# Altium project ECSE478 - DAQ Device.PrjPcb (part 2 of 4)

## Sheet Microcontroller.SchDoc: Microcontroller
size B; DrawnBy: Jasper Yun; SheetNumber: 5; SheetTotal: 13; Competition: SAC 2021; Subteam: Avionics; University: McGill University; Location: Montreal, Quebec; Project: Avionics Project Name; MRT: McGill Rocket Team
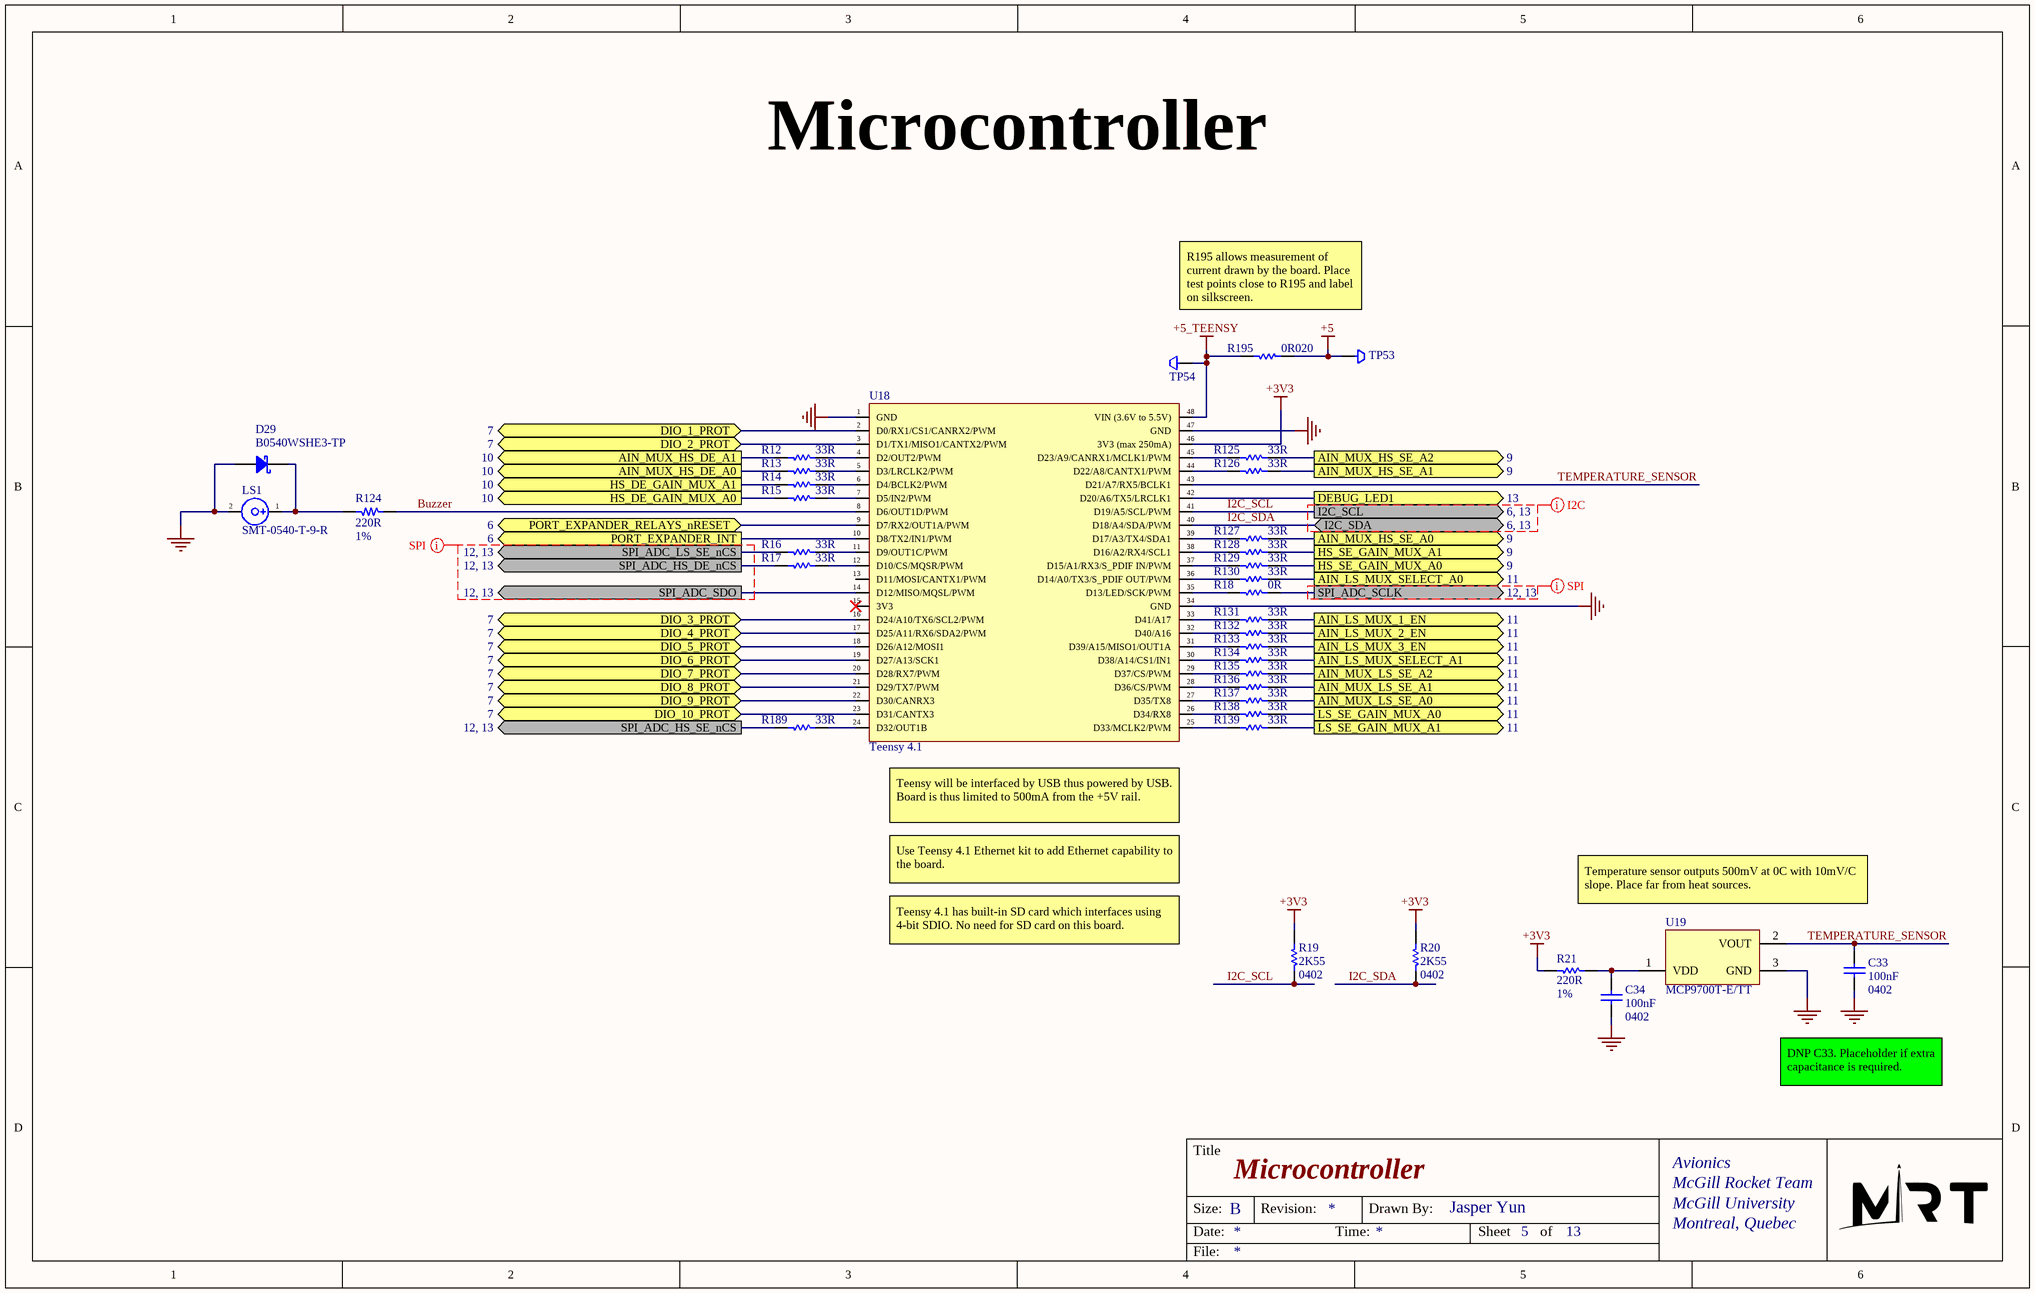
[diagram p4: Microcontroller.SchDoc]

### Parts
C33  100nF  value 0402  [0402 CAP]
C34  100nF  value 0402  [0402 CAP]
D29  B0540WSHE3-TP  [Diode SOD323-F]
LS1  SMT-0540-T-9-R  [Buzzer SMT-0540-T-9-R]
R12  33R  [0402 RES]
R13  33R  [0402 RES]
R14  33R  [0402 RES]
R15  33R  [0402 RES]
R16  33R  [0402 RES]
R17  33R  [0402 RES]
R18  0R  [0402 RES]
R19  2K55  value 0402  [0402 RES]
R20  2K55  value 0402  [0402 RES]
R21  220R  value 1%  [0402 RES]
R124  220R  Tolerance: 1%  [0402 RES]
R125  33R  [0402 RES]
R126  33R  [0402 RES]
R127  33R  [0402 RES]
R128  33R  [0402 RES]
R129  33R  [0402 RES]
R130  33R  [0402 RES]
R131  33R  [0402 RES]
R132  33R  [0402 RES]
R133  33R  [0402 RES]
R134  33R  [0402 RES]
R135  33R  [0402 RES]
R136  33R  [0402 RES]
R137  33R  [0402 RES]
R138  33R  [0402 RES]
R139  33R  [0402 RES]
R189  33R  [0402 RES]
R195  0R020  [0805 RES]
TP53  Test Point - Keystone 5015  [Test Point Keystone 5015]  (value not drawn)
TP54  Test Point - Keystone 5015  [Test Point Keystone 5015]  (value not drawn)
U18  Teensy 4.1  [Teensy 4.1]
U19  MCP9700T-E/TT  [SOT-23-TT3_M]

### Ports
AIN_LS_MUX_1_EN (out, see 11), AIN_LS_MUX_2_EN (out, see 11), AIN_LS_MUX_3_EN (out, see 11), AIN_LS_MUX_SELECT_A0 (out, see 11), AIN_LS_MUX_SELECT_A1 (out, see 11), AIN_MUX_HS_DE_A0 (out, see 10), AIN_MUX_HS_DE_A1 (out, see 10), AIN_MUX_HS_SE_A0 (out, see 9), AIN_MUX_HS_SE_A1 (out, see 9), AIN_MUX_HS_SE_A2 (out, see 9), AIN_MUX_LS_SE_A0 (out, see 11), AIN_MUX_LS_SE_A1 (out, see 11), AIN_MUX_LS_SE_A2 (out, see 11), DEBUG_LED1 (out, see 13), DIO_1_PROT (bidir, see 7), DIO_2_PROT (bidir, see 7), DIO_3_PROT (bidir, see 7), DIO_4_PROT (bidir, see 7), DIO_5_PROT (bidir, see 7), DIO_6_PROT (bidir, see 7), DIO_7_PROT (bidir, see 7), DIO_8_PROT (bidir, see 7), DIO_9_PROT (bidir, see 7), DIO_10_PROT (bidir, see 7), HS_DE_GAIN_MUX_A0 (out, see 10), HS_DE_GAIN_MUX_A1 (out, see 10), HS_SE_GAIN_MUX_A0 (out, see 9), HS_SE_GAIN_MUX_A1 (out, see 9), I2C_SCL (out, see 6, 13), I2C_SDA (bidir, see 6, 13), LS_SE_GAIN_MUX_A0 (out, see 11), LS_SE_GAIN_MUX_A1 (out, see 11), PORT_EXPANDER_INT (out, see 6), PORT_EXPANDER_RELAYS_nRESET (bidir, see 6), SPI_ADC_HS_DE_nCS (out, see 12, 13), SPI_ADC_HS_SE_nCS (out, see 12, 13), SPI_ADC_LS_SE_nCS (out, see 12, 13), SPI_ADC_SCLK (out, see 12, 13), SPI_ADC_SDO (out, see 12, 13)

### Nets
+3V3: R19.1 R20.1 R21.1 U18.46(3V3_(max_250mA))
+5: R195.2 TP53.1
+5_TEENSY: R195.1 TP54.1 U18.48(VIN_(3.6V_to_5.5V))
GND: C33.1 C34.1 D29.1 LS1.2(K) U18.1(GND) U18.34(GND) U18.47(GND) U19.3(GND)
AIN_LS_MUX_1_EN: R131.2 ; port AIN_LS_MUX_1_EN
AIN_LS_MUX_2_EN: R132.2 ; port AIN_LS_MUX_2_EN
AIN_LS_MUX_3_EN: R133.2 ; port AIN_LS_MUX_3_EN
AIN_LS_MUX_SELECT_A0: R130.2 ; port AIN_LS_MUX_SELECT_A0
AIN_LS_MUX_SELECT_A1: R134.2 ; port AIN_LS_MUX_SELECT_A1
AIN_MUX_HS_DE_A0: R13.1 ; port AIN_MUX_HS_DE_A0
AIN_MUX_HS_DE_A1: R12.1 ; port AIN_MUX_HS_DE_A1
AIN_MUX_HS_SE_A0: R127.2 ; port AIN_MUX_HS_SE_A0
AIN_MUX_HS_SE_A1: R126.2 ; port AIN_MUX_HS_SE_A1
AIN_MUX_HS_SE_A2: R125.2 ; port AIN_MUX_HS_SE_A2
AIN_MUX_LS_SE_A0: R137.2 ; port AIN_MUX_LS_SE_A0
AIN_MUX_LS_SE_A1: R136.2 ; port AIN_MUX_LS_SE_A1
AIN_MUX_LS_SE_A2: R135.2 ; port AIN_MUX_LS_SE_A2
Buzzer: R124.1 U18.8(D6/OUT1D/PWM)
DEBUG_LED1: U18.42(D20/A6/TX5/LRCLK1) ; port DEBUG_LED1
DIO_1_PROT: U18.2(D0/RX1/CS1/CANRX2/PWM) ; port DIO_1_PROT
DIO_2_PROT: U18.3(D1/TX1/MISO1/CANTX2/PWM) ; port DIO_2_PROT
DIO_3_PROT: U18.16(D24/A10/TX6/SCL2/PWM) ; port DIO_3_PROT
DIO_4_PROT: U18.17(D25/A11/RX6/SDA2/PWM) ; port DIO_4_PROT
DIO_5_PROT: U18.18(D26/A12/MOSI1) ; port DIO_5_PROT
DIO_6_PROT: U18.19(D27/A13/SCK1) ; port DIO_6_PROT
DIO_7_PROT: U18.20(D28/RX7/PWM) ; port DIO_7_PROT
DIO_8_PROT: U18.21(D29/TX7/PWM) ; port DIO_8_PROT
DIO_9_PROT: U18.22(D30/CANRX3) ; port DIO_9_PROT
DIO_10_PROT: U18.23(D31/CANTX3) ; port DIO_10_PROT
HS_DE_GAIN_MUX_A0: R15.1 ; port HS_DE_GAIN_MUX_A0
HS_DE_GAIN_MUX_A1: R14.1 ; port HS_DE_GAIN_MUX_A1
HS_SE_GAIN_MUX_A0: R129.2 ; port HS_SE_GAIN_MUX_A0
HS_SE_GAIN_MUX_A1: R128.2 ; port HS_SE_GAIN_MUX_A1
I2C_SCL: R19.2 U18.41(D19/A5/SCL/PWM) ; port I2C_SCL
I2C_SDA: R20.2 U18.40(D18/A4/SDA/PWM) ; port I2C_SDA
INT: U18.10(D8/TX2/IN1/PWM) ; port PORT_EXPANDER_INT
LS_SE_GAIN_MUX_A0: R138.2 ; port LS_SE_GAIN_MUX_A0
LS_SE_GAIN_MUX_A1: R139.2 ; port LS_SE_GAIN_MUX_A1
nRESET: U18.9(D7/RX2/OUT1A/PWM) ; port PORT_EXPANDER_RELAYS_nRESET
SPI_ADC_HS_DE_nCS: R17.1 ; port SPI_ADC_HS_DE_nCS
SPI_ADC_HS_SE_nCS: R189.1 ; port SPI_ADC_HS_SE_nCS
SPI_ADC_LS_SE_nCS: R16.1 ; port SPI_ADC_LS_SE_nCS
SPI_ADC_SCLK: R18.2 ; port SPI_ADC_SCLK
SPI_ADC_SDO: U18.14(D12/MISO/MQSL/PWM) ; port SPI_ADC_SDO
TEMPERATURE_SENSOR: C33.2 U18.43(D21/A7/RX5/BCLK1) U19.2(VOUT)
NetC34_2: C34.2 R21.2 U19.1(VDD)
NetD29_2: D29.2 LS1.1(A) R124.2
NetR12_2: R12.2 U18.4(D2/OUT2/PWM)
NetR13_2: R13.2 U18.5(D3/LRCLK2/PWM)
NetR14_2: R14.2 U18.6(D4/BCLK2/PWM)
NetR15_2: R15.2 U18.7(D5/IN2/PWM)
NetR16_2: R16.2 U18.11(D9/OUT1C/PWM)
NetR17_2: R17.2 U18.12(D10/CS/MQSR/PWM)
NetR18_1: R18.1 U18.35(D13/LED/SCK/PWM)
NetR125_1: R125.1 U18.45(D23/A9/CANRX1/MCLK1/PWM)
NetR126_1: R126.1 U18.44(D22/A8/CANTX1/PWM)
NetR127_1: R127.1 U18.39(D17/A3/TX4/SDA1)
NetR128_1: R128.1 U18.38(D16/A2/RX4/SCL1)
NetR129_1: R129.1 U18.37(D15/A1/RX3/S_PDIF_IN/PWM)
NetR130_1: R130.1 U18.36(D14/A0/TX3/S_PDIF_OUT/PWM)
NetR131_1: R131.1 U18.33(D41/A17)
NetR132_1: R132.1 U18.32(D40/A16)
NetR133_1: R133.1 U18.31(D39/A15/MISO1/OUT1A)
NetR134_1: R134.1 U18.30(D38/A14/CS1/IN1)
NetR135_1: R135.1 U18.29(D37/CS/PWM)
NetR136_1: R136.1 U18.28(D36/CS/PWM)
NetR137_1: R137.1 U18.27(D35/TX8)
NetR138_1: R138.1 U18.26(D34/RX8)
NetR139_1: R139.1 U18.25(D33/MCLK2/PWM)
NetR189_2: R189.2 U18.24(D32/OUT1B)

Not connected (* = marked no-connect by the designer): U18 13(D11/MOSI/CANTX1/PWM) 15(3V3)*

### Layout directives
net class I2C: (no net found under the mark)
net class SPI: (no net found under the mark)

### Notes on the sheet
- R195 allows measurement of current drawn by the board. Place test points close to R195 and label on silkscreen.
- (near U18) Teensy will be interfaced by USB thus powered by USB. Board is thus limited to 500mA from the +5V rail.
- Use Teensy 4.1 Ethernet kit to add Ethernet capability to the board.
- Temperature sensor outputs 500mV at 0C with 10mV/C slope. Place far from heat sources.
- Teensy 4.1 has built-in SD card which interfaces using 4-bit SDIO. No need for SD card on this board.
- DNP C33. Placeholder if extra capacitance is required.
- Title
- Size:
- Date:
- B
- Revision:
- Time:
- Drawn By:
- Sheet
- of
- File:

### Library data of the parts
C33 C34 = Cap: Capacitor; Published: 8-Jun-2000; LatestRevisionDate: 17-Jul-2002; LatestRevisionNote: Re-released for DXP Platform.; PackageReference: RAD-0.3; Publisher: Altium Limited; PackageDescription: Radial Cap, Thru-Hole; 2 Leads; 0.3 in Pin Spacing
D29 = Diode Schottky: Generic Schottky Diode
LS1 = Buzzer HNB09A05: CMT-9648-85T / Magnetic buzzer
R12-R18 R125-R139 R189 R195 = Res1: Resistor; Value: 1%; Published: 8-Jun-2000; LatestRevisionDate: 17-Jul-2002; LatestRevisionNote: Re-released for DXP Platform.; PackageReference: AXIAL-0.3; Publisher: Altium Limited; PackageDescription: Axial Device, Thru-Hole; 2 Leads; 0.3 in Pin Spacing
R19-R21 = Res1: Resistor; Published: 8-Jun-2000; LatestRevisionDate: 17-Jul-2002; LatestRevisionNote: Re-released for DXP Platform.; PackageReference: AXIAL-0.3; Publisher: Altium Limited; PackageDescription: Axial Device, Thru-Hole; 2 Leads; 0.3 in Pin Spacing
R124 = Resistor: Generic resistor
TP53 TP54 = Test Point - Keystone 5015: Keystone 5015 Test point
U18 = Teensy 4.1: Teensy 4.1 breakout (no ethernet or USB host pins exposed)
U19 = CMP-0192-00220-1: Low-Power Linear Active Thermistor IC, 3-Pin SOT-23, Extended Temperature, Tape and Reel; DatasheetVersion: revE, Apr-2009; PackageVersion: revBB, Aug-2009; PackageReference: SOT-23-TT3; Code_IPC: SOT23-3; PackageDescription: 3-Lead Plastic Small Outline Transistor (TT) [SOT-23]

## Sheet IO Expansion.SchDoc: IO Expansion
size B; DrawnBy: Jasper Yun; SheetNumber: 6; SheetTotal: 13; Competition: SAC 2021; Subteam: Avionics; University: McGill University; Location: Montreal, Quebec; Project: Avionics Project Name; MRT: McGill Rocket Team
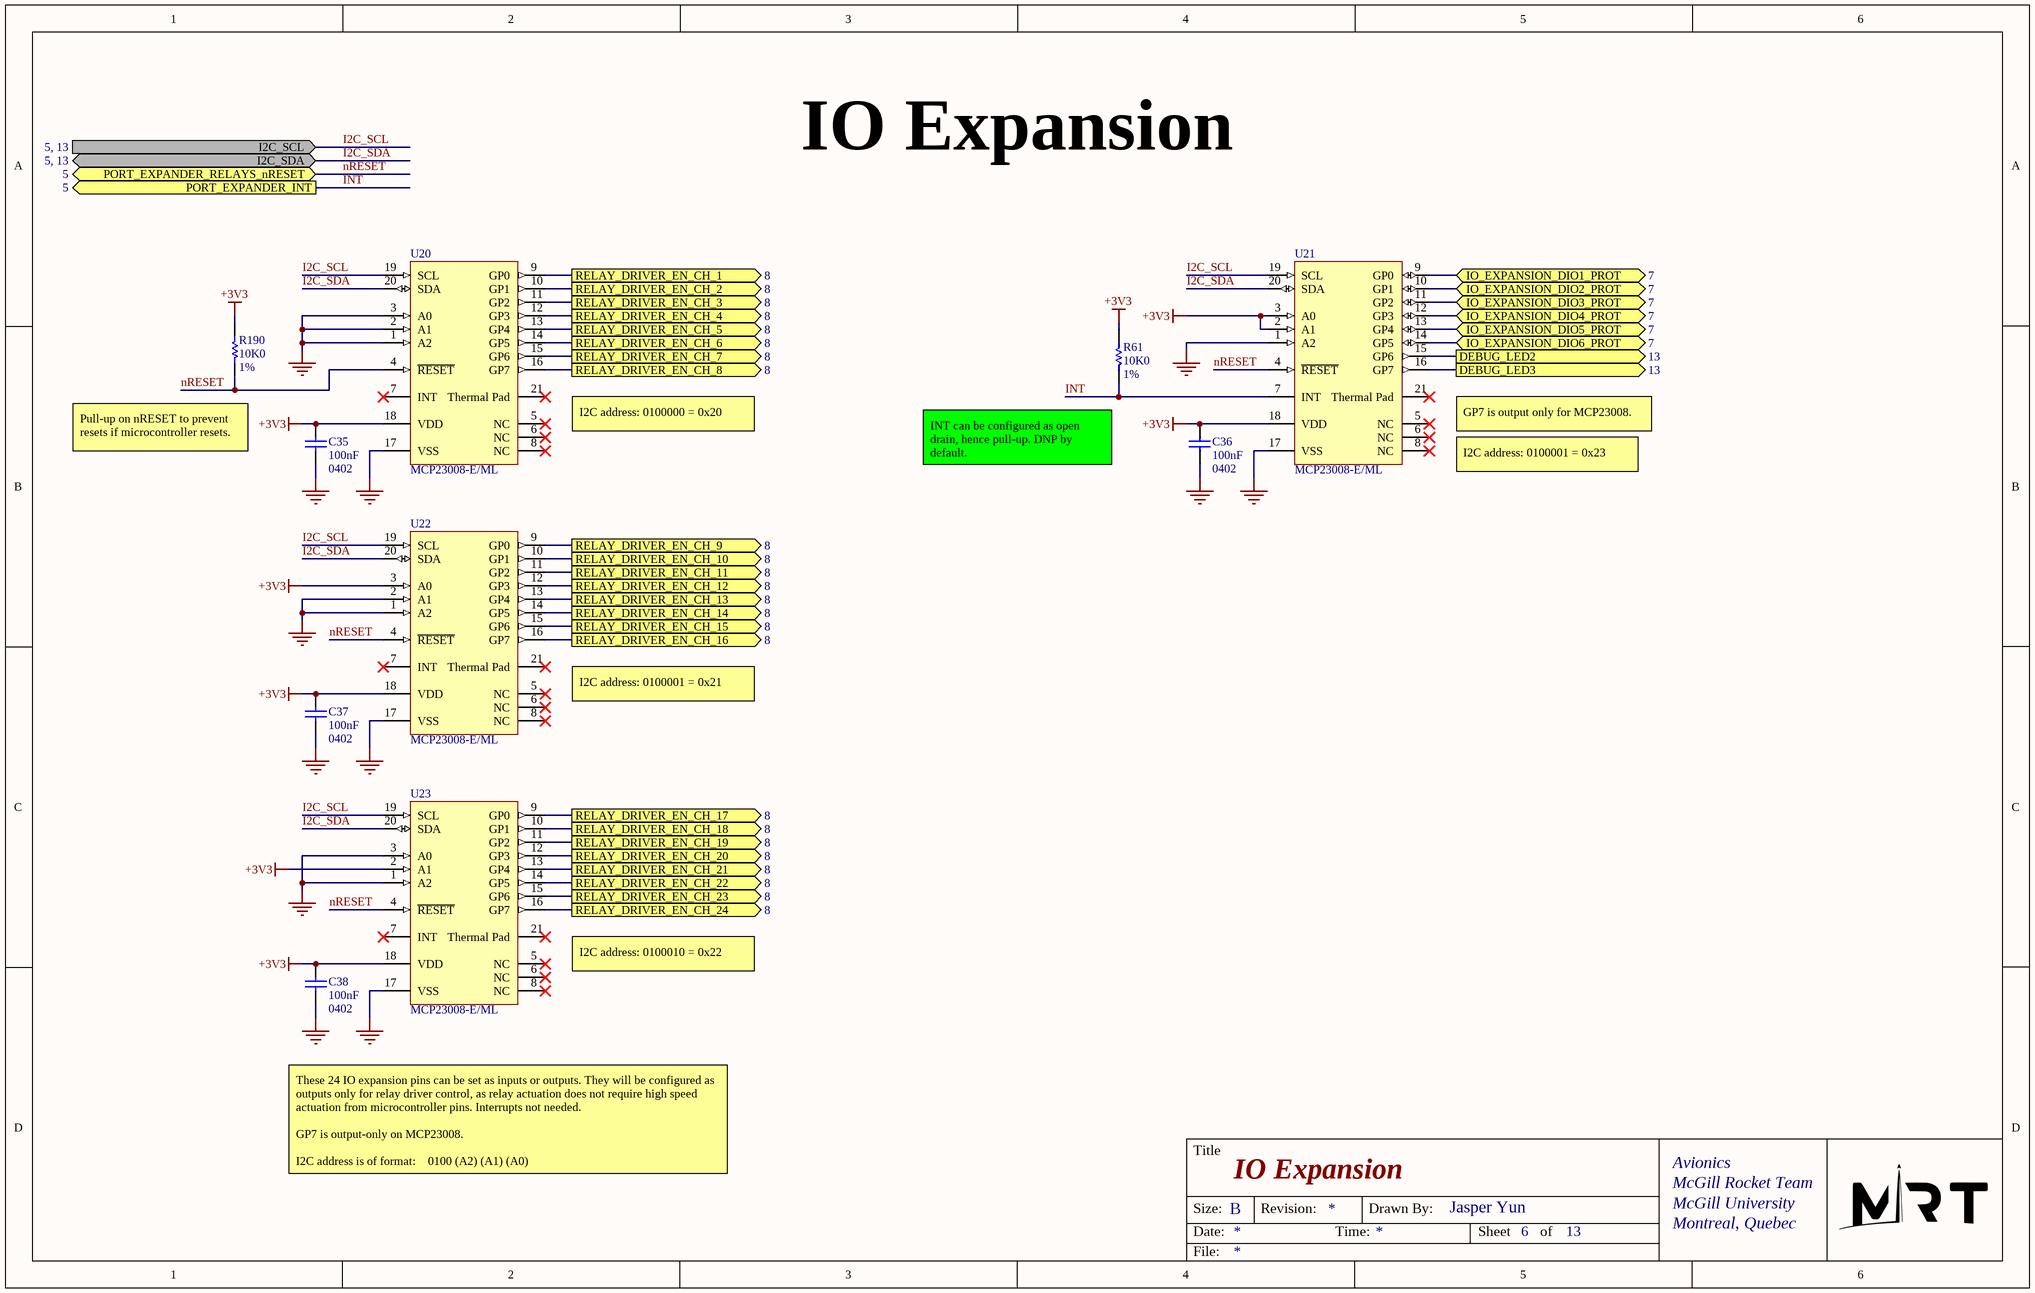
[diagram p5: IO Expansion.SchDoc]

### Parts
C35  100nF  value 0402  [0402 CAP]
C36  100nF  value 0402  [0402 CAP]
C37  100nF  value 0402  [0402 CAP]
C38  100nF  value 0402  [0402 CAP]
R61  10K0  value 1%  [0402 RES]
R190  10K0  value 1%  [0402 RES]
U20  MCP23008-E/ML  [QFN-ML20_M]
U21  MCP23008-E/ML  [QFN-ML20_M]
U22  MCP23008-E/ML  [QFN-ML20_M]
U23  MCP23008-E/ML  [QFN-ML20_M]

### Ports
DEBUG_LED2 (out, see 13), DEBUG_LED3 (out, see 13), I2C_SCL (in, see 5, 13), I2C_SDA (bidir, see 5, 13), IO_EXPANSION_DIO1_PROT (bidir, see 7), IO_EXPANSION_DIO2_PROT (bidir, see 7), IO_EXPANSION_DIO3_PROT (bidir, see 7), IO_EXPANSION_DIO4_PROT (bidir, see 7), IO_EXPANSION_DIO5_PROT (bidir, see 7), IO_EXPANSION_DIO6_PROT (bidir, see 7), PORT_EXPANDER_INT (out, see 5), PORT_EXPANDER_RELAYS_nRESET (bidir, see 5), RELAY_DRIVER_EN_CH_1 (out, see 8), RELAY_DRIVER_EN_CH_2 (out, see 8), RELAY_DRIVER_EN_CH_3 (out, see 8), RELAY_DRIVER_EN_CH_4 (out, see 8), RELAY_DRIVER_EN_CH_5 (out, see 8), RELAY_DRIVER_EN_CH_6 (out, see 8), RELAY_DRIVER_EN_CH_7 (out, see 8), RELAY_DRIVER_EN_CH_8 (out, see 8), RELAY_DRIVER_EN_CH_9 (out, see 8), RELAY_DRIVER_EN_CH_10 (out, see 8), RELAY_DRIVER_EN_CH_11 (out, see 8), RELAY_DRIVER_EN_CH_12 (out, see 8), RELAY_DRIVER_EN_CH_13 (out, see 8), RELAY_DRIVER_EN_CH_14 (out, see 8), RELAY_DRIVER_EN_CH_15 (out, see 8), RELAY_DRIVER_EN_CH_16 (out, see 8), RELAY_DRIVER_EN_CH_17 (out, see 8), RELAY_DRIVER_EN_CH_18 (out, see 8), RELAY_DRIVER_EN_CH_19 (out, see 8), RELAY_DRIVER_EN_CH_20 (out, see 8), RELAY_DRIVER_EN_CH_21 (out, see 8), RELAY_DRIVER_EN_CH_22 (out, see 8), RELAY_DRIVER_EN_CH_23 (out, see 8), RELAY_DRIVER_EN_CH_24 (out, see 8)

### Nets
+3V3: C35.2 C36.2 C37.2 C38.2 R61.1 R190.1 U20.18(VDD) U21.2(A1) U21.3(A0) U21.18(VDD) U22.3(A0) U22.18(VDD) U23.2(A1) U23.18(VDD)
GND: C35.1 C36.1 C37.1 C38.1 U20.1(A2) U20.2(A1) U20.3(A0) U20.17(VSS) U21.1(A2) U21.17(VSS) U22.1(A2) U22.2(A1) U22.17(VSS) U23.1(A2) U23.3(A0) U23.17(VSS)
DEBUG_LED2: U21.15(GP6) ; port DEBUG_LED2
DEBUG_LED3: U21.16(GP7) ; port DEBUG_LED3
I2C_SCL: U20.19(SCL) U21.19(SCL) U22.19(SCL) U23.19(SCL) ; port I2C_SCL
I2C_SDA: U20.20(SDA) U21.20(SDA) U22.20(SDA) U23.20(SDA) ; port I2C_SDA
INT: R61.2 U21.7(INT) ; port PORT_EXPANDER_INT
IO_EXPANSION_DIO1_PROT: U21.9(GP0) ; port IO_EXPANSION_DIO1_PROT
IO_EXPANSION_DIO2_PROT: U21.10(GP1) ; port IO_EXPANSION_DIO2_PROT
IO_EXPANSION_DIO3_PROT: U21.11(GP2) ; port IO_EXPANSION_DIO3_PROT
IO_EXPANSION_DIO4_PROT: U21.12(GP3) ; port IO_EXPANSION_DIO4_PROT
IO_EXPANSION_DIO5_PROT: U21.13(GP4) ; port IO_EXPANSION_DIO5_PROT
IO_EXPANSION_DIO6_PROT: U21.14(GP5) ; port IO_EXPANSION_DIO6_PROT
nRESET: R190.2 U20.4(~{RESET}) U21.4(~{RESET}) U22.4(~{RESET}) U23.4(~{RESET}) ; port PORT_EXPANDER_RELAYS_nRESET
RELAY_DRIVER_EN_CH_1: U20.9(GP0) ; port RELAY_DRIVER_EN_CH_1
RELAY_DRIVER_EN_CH_2: U20.10(GP1) ; port RELAY_DRIVER_EN_CH_2
RELAY_DRIVER_EN_CH_3: U20.11(GP2) ; port RELAY_DRIVER_EN_CH_3
RELAY_DRIVER_EN_CH_4: U20.12(GP3) ; port RELAY_DRIVER_EN_CH_4
RELAY_DRIVER_EN_CH_5: U20.13(GP4) ; port RELAY_DRIVER_EN_CH_5
RELAY_DRIVER_EN_CH_6: U20.14(GP5) ; port RELAY_DRIVER_EN_CH_6
RELAY_DRIVER_EN_CH_7: U20.15(GP6) ; port RELAY_DRIVER_EN_CH_7
RELAY_DRIVER_EN_CH_8: U20.16(GP7) ; port RELAY_DRIVER_EN_CH_8
RELAY_DRIVER_EN_CH_9: U22.9(GP0) ; port RELAY_DRIVER_EN_CH_9
RELAY_DRIVER_EN_CH_10: U22.10(GP1) ; port RELAY_DRIVER_EN_CH_10
RELAY_DRIVER_EN_CH_11: U22.11(GP2) ; port RELAY_DRIVER_EN_CH_11
RELAY_DRIVER_EN_CH_12: U22.12(GP3) ; port RELAY_DRIVER_EN_CH_12
RELAY_DRIVER_EN_CH_13: U22.13(GP4) ; port RELAY_DRIVER_EN_CH_13
RELAY_DRIVER_EN_CH_14: U22.14(GP5) ; port RELAY_DRIVER_EN_CH_14
RELAY_DRIVER_EN_CH_15: U22.15(GP6) ; port RELAY_DRIVER_EN_CH_15
RELAY_DRIVER_EN_CH_16: U22.16(GP7) ; port RELAY_DRIVER_EN_CH_16
RELAY_DRIVER_EN_CH_17: U23.9(GP0) ; port RELAY_DRIVER_EN_CH_17
RELAY_DRIVER_EN_CH_18: U23.10(GP1) ; port RELAY_DRIVER_EN_CH_18
RELAY_DRIVER_EN_CH_19: U23.11(GP2) ; port RELAY_DRIVER_EN_CH_19
RELAY_DRIVER_EN_CH_20: U23.12(GP3) ; port RELAY_DRIVER_EN_CH_20
RELAY_DRIVER_EN_CH_21: U23.13(GP4) ; port RELAY_DRIVER_EN_CH_21
RELAY_DRIVER_EN_CH_22: U23.14(GP5) ; port RELAY_DRIVER_EN_CH_22
RELAY_DRIVER_EN_CH_23: U23.15(GP6) ; port RELAY_DRIVER_EN_CH_23
RELAY_DRIVER_EN_CH_24: U23.16(GP7) ; port RELAY_DRIVER_EN_CH_24

Not connected (* = marked no-connect by the designer): U20 5(NC)* 6(NC)* 7(INT)* 8(NC)* 21(Thermal_Pad)*; U21 5(NC)* 6(NC)* 8(NC)* 21(Thermal_Pad)*; U22 5(NC)* 6(NC)* 7(INT)* 8(NC)* 21(Thermal_Pad)*; U23 5(NC)* 6(NC)* 7(INT)* 8(NC)* 21(Thermal_Pad)*

### Notes on the sheet
- I2C address: 0100000 = 0x20
- GP7 is output only for MCP23008.
- (near R190) Pull-up on nRESET to prevent resets if microcontroller resets.
- (near R61) INT can be configured as open drain, hence pull-up. DNP by default.
- I2C address: 0100001 = 0x23
- I2C address: 0100001 = 0x21
- I2C address: 0100010 = 0x22
- These 24 IO expansion pins can be set as inputs or outputs. They will be configured as outputs only for relay driver control, as relay actuation does not require high speed actuation from microcontroller pins. Interrupts not needed.
  GP7 is output-only on MCP23008.
  I2C address is of format:    0100 (A2) (A1) (A0)
- Title
- Size:
- Date:
- B
- Revision:
- Time:
- Drawn By:
- Sheet
- of
- File:

### Library data of the parts
C35-C38 = Cap: Capacitor; Published: 8-Jun-2000; LatestRevisionDate: 17-Jul-2002; LatestRevisionNote: Re-released for DXP Platform.; PackageReference: RAD-0.3; Publisher: Altium Limited; PackageDescription: Radial Cap, Thru-Hole; 2 Leads; 0.3 in Pin Spacing
R61 R190 = Res1: Resistor; Published: 8-Jun-2000; LatestRevisionDate: 17-Jul-2002; LatestRevisionNote: Re-released for DXP Platform.; PackageReference: AXIAL-0.3; Publisher: Altium Limited; PackageDescription: Axial Device, Thru-Hole; 2 Leads; 0.3 in Pin Spacing
U20-U23 = CMP-0186-00018-2: 8-Bit I/O Expander with Serial Interface, 20-Pin QFN, Extended Temperature; ComponentLink2URL: http://ww1.microchip.com/downloads/en/DeviceDoc/21919e.pdf; ComponentLink1Description: Manufacturer URL; ComponentLink3Description: Package Specification; ComponentLink1URL: http://www.microchip.com/; RevisionNote: URLs added.; PackageReference: QFN-ML20; ComponentLink2Description: Datasheet; PackageDescription: 20-Lead Plastic Quad Flat, No Lead Package (ML) - 4x4x0.9 mm Body [QFN]; ComponentLink3URL: http://www.microchip.com/stellent/groups/techpub_sg/documents/packagingspec/en012702.pdf; DatasheetVersion: revE, Aug-2007; PackageVersion: revBB, Aug-2009

## Sheet Digital IO Protection.SchDoc: Digital IO Protection
size B; DrawnBy: Jasper Yun; SheetNumber: 7; SheetTotal: 13; Competition: SAC 2021; Subteam: Avionics; University: McGill University; Location: Montreal, Quebec; Project: Avionics Project Name; MRT: McGill Rocket Team
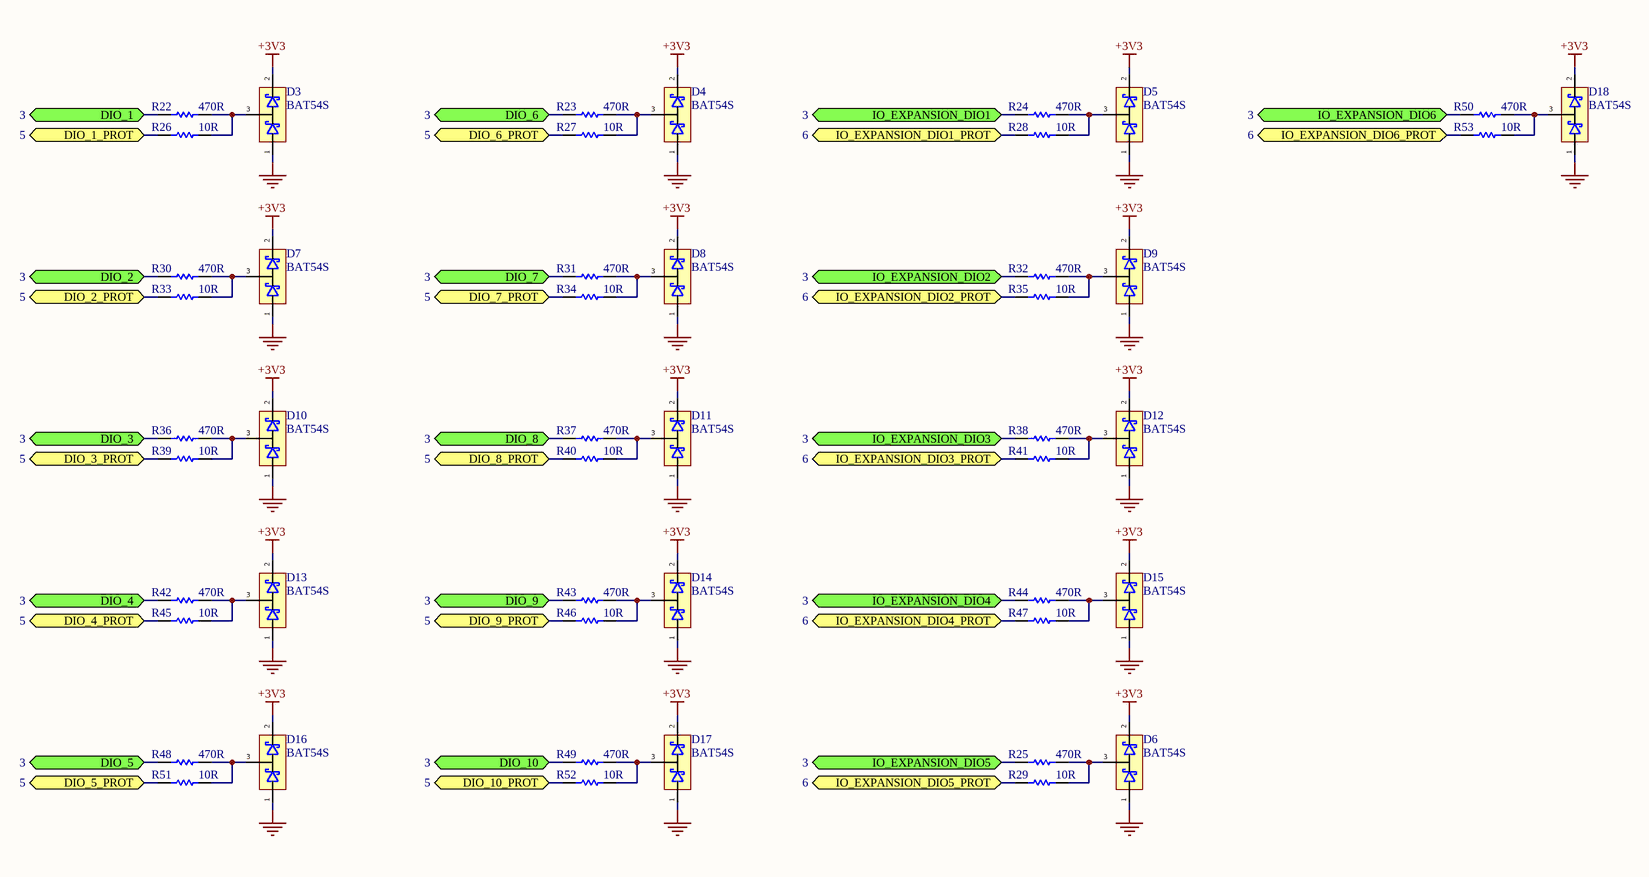
[diagram p6: Digital IO Protection.SchDoc]

### Parts
D3  BAT54S  [SOT23-3]
D4  BAT54S  [SOT23-3]
D5  BAT54S  [SOT23-3]
D6  BAT54S  [SOT23-3]
D7  BAT54S  [SOT23-3]
D8  BAT54S  [SOT23-3]
D9  BAT54S  [SOT23-3]
D10  BAT54S  [SOT23-3]
D11  BAT54S  [SOT23-3]
D12  BAT54S  [SOT23-3]
D13  BAT54S  [SOT23-3]
D14  BAT54S  [SOT23-3]
D15  BAT54S  [SOT23-3]
D16  BAT54S  [SOT23-3]
D17  BAT54S  [SOT23-3]
D18  BAT54S  [SOT23-3]
R22  470R  [0805 RES]
R23  470R  [0805 RES]
R24  470R  [0805 RES]
R25  470R  [0805 RES]
R26  10R  [0603 RES]
R27  10R  [0603 RES]
R28  10R  [0603 RES]
R29  10R  [0603 RES]
R30  470R  [0805 RES]
R31  470R  [0805 RES]
R32  470R  [0805 RES]
R33  10R  [0603 RES]
R34  10R  [0603 RES]
R35  10R  [0603 RES]
R36  470R  [0805 RES]
R37  470R  [0805 RES]
R38  470R  [0805 RES]
R39  10R  [0603 RES]
R40  10R  [0603 RES]
R41  10R  [0603 RES]
R42  470R  [0805 RES]
R43  470R  [0805 RES]
R44  470R  [0805 RES]
R45  10R  [0603 RES]
R46  10R  [0603 RES]
R47  10R  [0603 RES]
R48  470R  [0805 RES]
R49  470R  [0805 RES]
R50  470R  [0805 RES]
R51  10R  [0603 RES]
R52  10R  [0603 RES]
R53  10R  [0603 RES]

### Ports
DIO_1 (bidir, see 3), DIO_1_PROT (bidir, see 5), DIO_2 (bidir, see 3), DIO_2_PROT (bidir, see 5), DIO_3 (bidir, see 3), DIO_3_PROT (bidir, see 5), DIO_4 (bidir, see 3), DIO_4_PROT (bidir, see 5), DIO_5 (bidir, see 3), DIO_5_PROT (bidir, see 5), DIO_6 (bidir, see 3), DIO_6_PROT (bidir, see 5), DIO_7 (bidir, see 3), DIO_7_PROT (bidir, see 5), DIO_8 (bidir, see 3), DIO_8_PROT (bidir, see 5), DIO_9 (bidir, see 3), DIO_9_PROT (bidir, see 5), DIO_10 (bidir, see 3), DIO_10_PROT (bidir, see 5), IO_EXPANSION_DIO1 (bidir, see 3), IO_EXPANSION_DIO1_PROT (bidir, see 6), IO_EXPANSION_DIO2 (bidir, see 3), IO_EXPANSION_DIO2_PROT (bidir, see 6), IO_EXPANSION_DIO3 (bidir, see 3), IO_EXPANSION_DIO3_PROT (bidir, see 6), IO_EXPANSION_DIO4 (bidir, see 3), IO_EXPANSION_DIO4_PROT (bidir, see 6), IO_EXPANSION_DIO5 (bidir, see 3), IO_EXPANSION_DIO5_PROT (bidir, see 6), IO_EXPANSION_DIO6 (bidir, see 3), IO_EXPANSION_DIO6_PROT (bidir, see 6)

### Nets
+3V3: D3.2 D4.2 D5.2 D6.2 D7.2 D8.2 D9.2 D10.2 D11.2 D12.2 D13.2 D14.2 D15.2 D16.2 D17.2 D18.2
GND: D3.1 D4.1 D5.1 D6.1 D7.1 D8.1 D9.1 D10.1 D11.1 D12.1 D13.1 D14.1 D15.1 D16.1 D17.1 D18.1
DIO_1: R22.1 ; port DIO_1
DIO_1_PROT: R26.1 ; port DIO_1_PROT
DIO_2: R30.1 ; port DIO_2
DIO_2_PROT: R33.1 ; port DIO_2_PROT
DIO_3: R36.1 ; port DIO_3
DIO_3_PROT: R39.1 ; port DIO_3_PROT
DIO_4: R42.1 ; port DIO_4
DIO_4_PROT: R45.1 ; port DIO_4_PROT
DIO_5: R48.1 ; port DIO_5
DIO_5_PROT: R51.1 ; port DIO_5_PROT
DIO_6: R23.1 ; port DIO_6
DIO_6_PROT: R27.1 ; port DIO_6_PROT
DIO_7: R31.1 ; port DIO_7
DIO_7_PROT: R34.1 ; port DIO_7_PROT
DIO_8: R37.1 ; port DIO_8
DIO_8_PROT: R40.1 ; port DIO_8_PROT
DIO_9: R43.1 ; port DIO_9
DIO_9_PROT: R46.1 ; port DIO_9_PROT
DIO_10: R49.1 ; port DIO_10
DIO_10_PROT: R52.1 ; port DIO_10_PROT
IO_EXPANSION_DIO1: R24.1 ; port IO_EXPANSION_DIO1
IO_EXPANSION_DIO1_PROT: R28.1 ; port IO_EXPANSION_DIO1_PROT
IO_EXPANSION_DIO2: R32.1 ; port IO_EXPANSION_DIO2
IO_EXPANSION_DIO2_PROT: R35.1 ; port IO_EXPANSION_DIO2_PROT
IO_EXPANSION_DIO3: R38.1 ; port IO_EXPANSION_DIO3
IO_EXPANSION_DIO3_PROT: R41.1 ; port IO_EXPANSION_DIO3_PROT
IO_EXPANSION_DIO4: R44.1 ; port IO_EXPANSION_DIO4
IO_EXPANSION_DIO4_PROT: R47.1 ; port IO_EXPANSION_DIO4_PROT
IO_EXPANSION_DIO5: R25.1 ; port IO_EXPANSION_DIO5
IO_EXPANSION_DIO5_PROT: R29.1 ; port IO_EXPANSION_DIO5_PROT
IO_EXPANSION_DIO6: R50.1 ; port IO_EXPANSION_DIO6
IO_EXPANSION_DIO6_PROT: R53.1 ; port IO_EXPANSION_DIO6_PROT
NetD3_3: D3.3 R22.2 R26.2
NetD4_3: D4.3 R23.2 R27.2
NetD5_3: D5.3 R24.2 R28.2
NetD6_3: D6.3 R25.2 R29.2
NetD7_3: D7.3 R30.2 R33.2
NetD8_3: D8.3 R31.2 R34.2
NetD9_3: D9.3 R32.2 R35.2
NetD10_3: D10.3 R36.2 R39.2
NetD11_3: D11.3 R37.2 R40.2
NetD12_3: D12.3 R38.2 R41.2
NetD13_3: D13.3 R42.2 R45.2
NetD14_3: D14.3 R43.2 R46.2
NetD15_3: D15.3 R44.2 R47.2
NetD16_3: D16.3 R48.2 R51.2
NetD17_3: D17.3 R49.2 R52.2
NetD18_3: D18.3 R50.2 R53.2

### Notes on the sheet
- Title
- Size:
- Date:
- B
- Revision:
- Time:
- Drawn By:
- Sheet
- of
- File:

### Library data of the parts
D3-D18 = Schottky Diode Array BAT54S: Rectifier Diode Small Signal Schottky 40V 0.3A 5ns 3-Pin SOT-23 T/R; Manufacturer: STMicroelectronics; Manufacturer Part Number: BAT54SFILM; Forward Current: 300mA; Peak Non-Repetitive Surge Current: 1A; Forward Voltage: 900mV; Max Reverse Current: 100uA; Max Reverse Leakage Current: 1uA; Element Configuration: Single; Voltage Rating (DC): 30V; Supplier 1: Digi-Key; RoHS: Yes; Category: Rectifier Diodes; Stock 1: 2760; Pricing 1: 1=0.34000, 10=0.27800, 100=0.14730, 500=0.09694, 1000=0.06592 (USD); Mount: Surface Mount; Case/Package: SOT-23; Number of Pins: 3; Weight: 0.1lb; Min Operating Temperature: -40°C; Max Operating Temperature: 150°C; Reverse Recovery Time: 5ns; Max Repetitive Reverse Voltage (Vrrm): 40V; Packaging: Tape and Reel; Package Quantity: 3000; Average Rectified Current: 300mA; Max Forward Surge Current (Ifsm): 1A; Max Reverse Voltage (DC): 40V; Max Surge Current: 1A; Recovery Time: 5ns; Termination: SMD/SMT; Current Rating: 300mA; Length: 2.9mm; Width: 3.05mm; Height: 0.95mm; Radiation Hardening: No; REACH SVHC: No SVHC; RoHS Compliant: Yes; Lead Free: Lead Free; ComponentLink1URL: https://datasheet.ciiva.com/1200/1689724-1200683.pdf?src-supplier=Farnell; ComponentLink1Description: https://datasheet.ciiva.com/1200/1689724-1200683.pdf?src-supplier=Farnell; ComponentLink2URL: https://datasheet.ciiva.com/1177/1689724-1177974.pdf?src-supplier=Element14; ComponentLink2Description: https://datasheet.ciiva.com/1177/1689724-1177974.pdf?src-supplier=Element14; ComponentLink3URL: https://datasheet.ciiva.com/1200/cd00001322-1200682.pdf?src-supplier=Farnell; ComponentLink3Description: https://datasheet.ciiva.com/1200/cd00001322-1200682.pdf?src-supplier=Farnell; ComponentLink4URL: https://datasheet.ciiva.com/14168/cd00001322-14168028.pdf?src-supplier=Distrelec; ComponentLink4Description: https://datasheet.ciiva.com/14168/cd00001322-14168028.pdf?src-supplier=Distrelec; ComponentLink5URL: https://datasheet.ciiva.com/905/cd00001322-905882.pdf?src-supplier=Digi-Key; ComponentLink5Description: https://datasheet.ciiva.com/905/cd00001322-905882.pdf?src-supplier=Digi-Key; ComponentLink6URL: https://datasheet.ciiva.com/905/cd00001322-905881.pdf?src-supplier=Digi-Key; ComponentLink6Description: https://datasheet.ciiva.com/905/cd00001322-905881.pdf?src-supplier=Digi-Key; ComponentLink7URL: https://datasheet.ciiva.com/905/cd00001322-905883.pdf?src-supplier=Digi-Key; ComponentLink7Description: https://datasheet.ciiva.com/905/cd00001322-905883.pdf?src-supplier=Digi-Key; ComponentLink8URL: https://datasheet.ciiva.com/1177/1689724-1177973.pdf?src-supplier=Element14; ComponentLink8Description: https://datasheet.ciiva.com/1177/1689724-1177973.pdf?src-supplier=Element14; Supplier Part Number 1: 497-2522-1-ND
R22-R53 = Res1: Published: 8-Jun-2000; LatestRevisionDate: 17-Jul-2002; LatestRevisionNote: Re-released for DXP Platform.; PackageReference: AXIAL-0.3; Publisher: Altium Limited; PackageDescription: Axial Device, Thru-Hole; 2 Leads; 0.3 in Pin Spacing
  R22-R25 R30-R32 R36-R38 R42-R44 R48-R50: Value: 470R
  R26-R29 R33-R35 R39-R41 R45-R47 R51-R53: Value: 10R

## Sheet Relay Drivers.SchDoc: Relay Drivers
size B; DrawnBy: Jasper Yun; SheetNumber: 8; SheetTotal: 13; Competition: SAC 2021; Subteam: Avionics; University: McGill University; Location: Montreal, Quebec; Project: Avionics Project Name; MRT: McGill Rocket Team
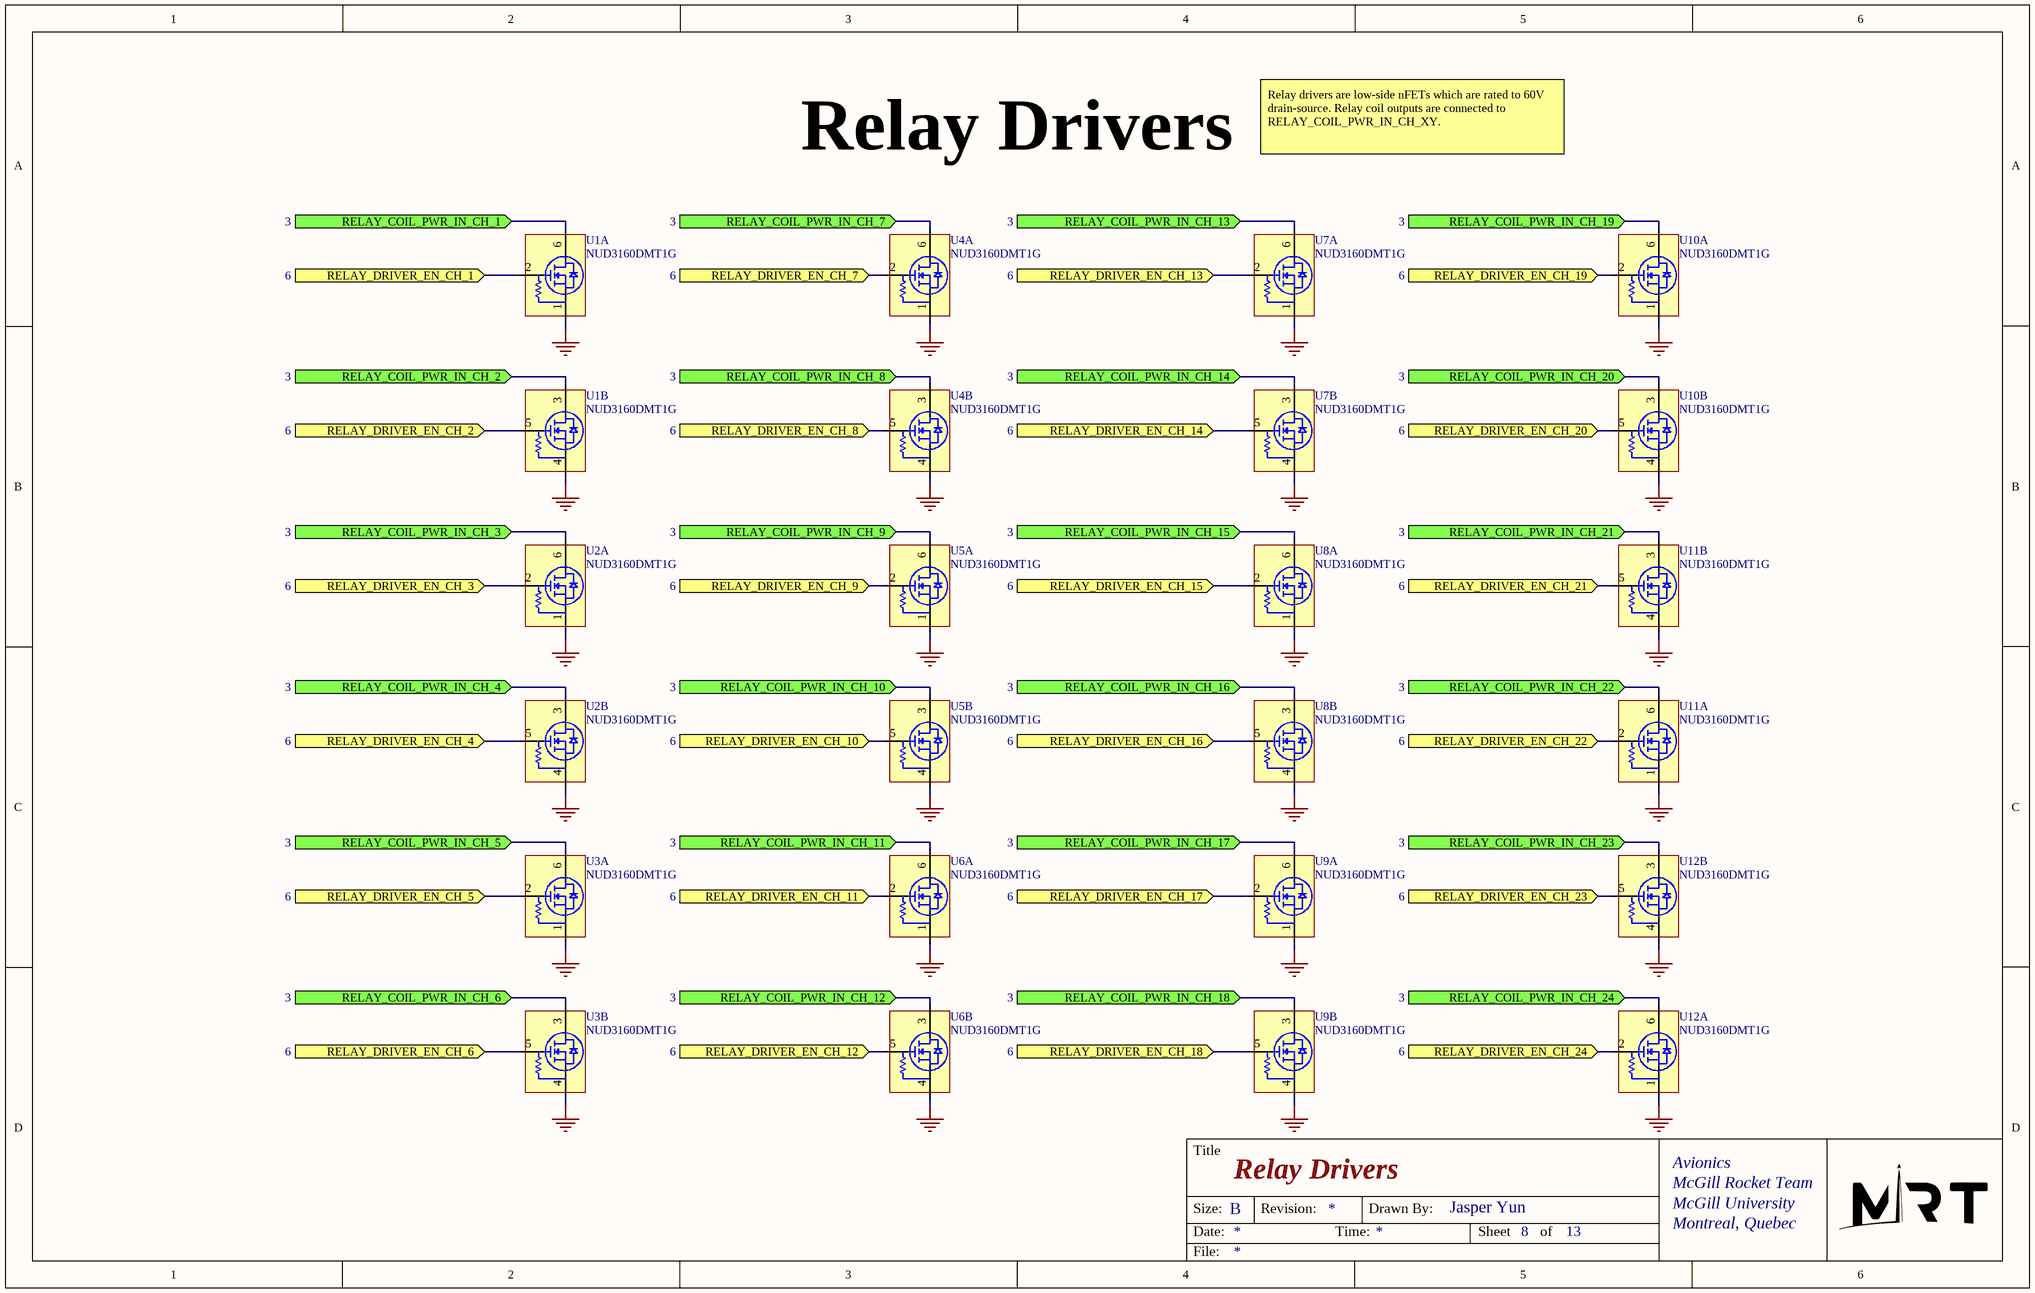
[diagram p7: Relay Drivers.SchDoc]

### Parts
U1  NUD3160DMT1G  [SOT23-6]  (parts A,B of 2)
U2  NUD3160DMT1G  [SOT23-6]  (parts A,B of 2)
U3  NUD3160DMT1G  [SOT23-6]  (parts A,B of 2)
U4  NUD3160DMT1G  [SOT23-6]  (parts A,B of 2)
U5  NUD3160DMT1G  [SOT23-6]  (parts A,B of 2)
U6  NUD3160DMT1G  [SOT23-6]  (parts A,B of 2)
U7  NUD3160DMT1G  [SOT23-6]  (parts A,B of 2)
U8  NUD3160DMT1G  [SOT23-6]  (parts A,B of 2)
U9  NUD3160DMT1G  [SOT23-6]  (parts A,B of 2)
U10  NUD3160DMT1G  [SOT23-6]  (parts A,B of 2)
U11  NUD3160DMT1G  [SOT23-6]  (parts A,B of 2)
U12  NUD3160DMT1G  [SOT23-6]  (parts A,B of 2)

### Ports
RELAY_COIL_PWR_IN_CH_1 (in, see 3), RELAY_COIL_PWR_IN_CH_2 (in, see 3), RELAY_COIL_PWR_IN_CH_3 (in, see 3), RELAY_COIL_PWR_IN_CH_4 (in, see 3), RELAY_COIL_PWR_IN_CH_5 (in, see 3), RELAY_COIL_PWR_IN_CH_6 (in, see 3), RELAY_COIL_PWR_IN_CH_7 (in, see 3), RELAY_COIL_PWR_IN_CH_8 (in, see 3), RELAY_COIL_PWR_IN_CH_9 (in, see 3), RELAY_COIL_PWR_IN_CH_10 (in, see 3), RELAY_COIL_PWR_IN_CH_11 (in, see 3), RELAY_COIL_PWR_IN_CH_12 (in, see 3), RELAY_COIL_PWR_IN_CH_13 (in, see 3), RELAY_COIL_PWR_IN_CH_14 (in, see 3), RELAY_COIL_PWR_IN_CH_15 (in, see 3), RELAY_COIL_PWR_IN_CH_16 (in, see 3), RELAY_COIL_PWR_IN_CH_17 (in, see 3), RELAY_COIL_PWR_IN_CH_18 (in, see 3), RELAY_COIL_PWR_IN_CH_19 (in, see 3), RELAY_COIL_PWR_IN_CH_20 (in, see 3), RELAY_COIL_PWR_IN_CH_21 (in, see 3), RELAY_COIL_PWR_IN_CH_22 (in, see 3), RELAY_COIL_PWR_IN_CH_23 (in, see 3), RELAY_COIL_PWR_IN_CH_24 (in, see 3), RELAY_DRIVER_EN_CH_1 (in, see 6), RELAY_DRIVER_EN_CH_2 (in, see 6), RELAY_DRIVER_EN_CH_3 (in, see 6), RELAY_DRIVER_EN_CH_4 (in, see 6), RELAY_DRIVER_EN_CH_5 (in, see 6), RELAY_DRIVER_EN_CH_6 (in, see 6), RELAY_DRIVER_EN_CH_7 (in, see 6), RELAY_DRIVER_EN_CH_8 (in, see 6), RELAY_DRIVER_EN_CH_9 (in, see 6), RELAY_DRIVER_EN_CH_10 (in, see 6), RELAY_DRIVER_EN_CH_11 (in, see 6), RELAY_DRIVER_EN_CH_12 (in, see 6), RELAY_DRIVER_EN_CH_13 (in, see 6), RELAY_DRIVER_EN_CH_14 (in, see 6), RELAY_DRIVER_EN_CH_15 (in, see 6), RELAY_DRIVER_EN_CH_16 (in, see 6), RELAY_DRIVER_EN_CH_17 (in, see 6), RELAY_DRIVER_EN_CH_18 (in, see 6), RELAY_DRIVER_EN_CH_19 (in, see 6), RELAY_DRIVER_EN_CH_20 (in, see 6), RELAY_DRIVER_EN_CH_21 (in, see 6), RELAY_DRIVER_EN_CH_22 (in, see 6), RELAY_DRIVER_EN_CH_23 (in, see 6), RELAY_DRIVER_EN_CH_24 (in, see 6)

### Nets
GND: U1.1(Source) U1.4(Source) U2.1(Source) U2.4(Source) U3.1(Source) U3.4(Source) U4.1(Source) U4.4(Source) U5.1(Source) U5.4(Source) U6.1(Source) U6.4(Source) U7.1(Source) U7.4(Source) U8.1(Source) U8.4(Source) U9.1(Source) U9.4(Source) U10.1(Source) U10.4(Source) U11.1(Source) U11.4(Source) U12.1(Source) U12.4(Source)
RELAY_COIL_PWR_IN_CH_1: U1.6(Drain) ; port RELAY_COIL_PWR_IN_CH_1
RELAY_COIL_PWR_IN_CH_2: U1.3(Drain) ; port RELAY_COIL_PWR_IN_CH_2
RELAY_COIL_PWR_IN_CH_3: U2.6(Drain) ; port RELAY_COIL_PWR_IN_CH_3
RELAY_COIL_PWR_IN_CH_4: U2.3(Drain) ; port RELAY_COIL_PWR_IN_CH_4
RELAY_COIL_PWR_IN_CH_5: U3.6(Drain) ; port RELAY_COIL_PWR_IN_CH_5
RELAY_COIL_PWR_IN_CH_6: U3.3(Drain) ; port RELAY_COIL_PWR_IN_CH_6
RELAY_COIL_PWR_IN_CH_7: U4.6(Drain) ; port RELAY_COIL_PWR_IN_CH_7
RELAY_COIL_PWR_IN_CH_8: U4.3(Drain) ; port RELAY_COIL_PWR_IN_CH_8
RELAY_COIL_PWR_IN_CH_9: U5.6(Drain) ; port RELAY_COIL_PWR_IN_CH_9
RELAY_COIL_PWR_IN_CH_10: U5.3(Drain) ; port RELAY_COIL_PWR_IN_CH_10
RELAY_COIL_PWR_IN_CH_11: U6.6(Drain) ; port RELAY_COIL_PWR_IN_CH_11
RELAY_COIL_PWR_IN_CH_12: U6.3(Drain) ; port RELAY_COIL_PWR_IN_CH_12
RELAY_COIL_PWR_IN_CH_13: U7.6(Drain) ; port RELAY_COIL_PWR_IN_CH_13
RELAY_COIL_PWR_IN_CH_14: U7.3(Drain) ; port RELAY_COIL_PWR_IN_CH_14
RELAY_COIL_PWR_IN_CH_15: U8.6(Drain) ; port RELAY_COIL_PWR_IN_CH_15
RELAY_COIL_PWR_IN_CH_16: U8.3(Drain) ; port RELAY_COIL_PWR_IN_CH_16
RELAY_COIL_PWR_IN_CH_17: U9.6(Drain) ; port RELAY_COIL_PWR_IN_CH_17
RELAY_COIL_PWR_IN_CH_18: U9.3(Drain) ; port RELAY_COIL_PWR_IN_CH_18
RELAY_COIL_PWR_IN_CH_19: U10.6(Drain) ; port RELAY_COIL_PWR_IN_CH_19
RELAY_COIL_PWR_IN_CH_20: U10.3(Drain) ; port RELAY_COIL_PWR_IN_CH_20
RELAY_COIL_PWR_IN_CH_21: U11.3(Drain) ; port RELAY_COIL_PWR_IN_CH_21
RELAY_COIL_PWR_IN_CH_22: U11.6(Drain) ; port RELAY_COIL_PWR_IN_CH_22
RELAY_COIL_PWR_IN_CH_23: U12.3(Drain) ; port RELAY_COIL_PWR_IN_CH_23
RELAY_COIL_PWR_IN_CH_24: U12.6(Drain) ; port RELAY_COIL_PWR_IN_CH_24
RELAY_DRIVER_EN_CH_1: U1.2(Gate) ; port RELAY_DRIVER_EN_CH_1
RELAY_DRIVER_EN_CH_2: U1.5(Gate) ; port RELAY_DRIVER_EN_CH_2
RELAY_DRIVER_EN_CH_3: U2.2(Gate) ; port RELAY_DRIVER_EN_CH_3
RELAY_DRIVER_EN_CH_4: U2.5(Gate) ; port RELAY_DRIVER_EN_CH_4
RELAY_DRIVER_EN_CH_5: U3.2(Gate) ; port RELAY_DRIVER_EN_CH_5
RELAY_DRIVER_EN_CH_6: U3.5(Gate) ; port RELAY_DRIVER_EN_CH_6
RELAY_DRIVER_EN_CH_7: U4.2(Gate) ; port RELAY_DRIVER_EN_CH_7
RELAY_DRIVER_EN_CH_8: U4.5(Gate) ; port RELAY_DRIVER_EN_CH_8
RELAY_DRIVER_EN_CH_9: U5.2(Gate) ; port RELAY_DRIVER_EN_CH_9
RELAY_DRIVER_EN_CH_10: U5.5(Gate) ; port RELAY_DRIVER_EN_CH_10
RELAY_DRIVER_EN_CH_11: U6.2(Gate) ; port RELAY_DRIVER_EN_CH_11
RELAY_DRIVER_EN_CH_12: U6.5(Gate) ; port RELAY_DRIVER_EN_CH_12
RELAY_DRIVER_EN_CH_13: U7.2(Gate) ; port RELAY_DRIVER_EN_CH_13
RELAY_DRIVER_EN_CH_14: U7.5(Gate) ; port RELAY_DRIVER_EN_CH_14
RELAY_DRIVER_EN_CH_15: U8.2(Gate) ; port RELAY_DRIVER_EN_CH_15
RELAY_DRIVER_EN_CH_16: U8.5(Gate) ; port RELAY_DRIVER_EN_CH_16
RELAY_DRIVER_EN_CH_17: U9.2(Gate) ; port RELAY_DRIVER_EN_CH_17
RELAY_DRIVER_EN_CH_18: U9.5(Gate) ; port RELAY_DRIVER_EN_CH_18
RELAY_DRIVER_EN_CH_19: U10.2(Gate) ; port RELAY_DRIVER_EN_CH_19
RELAY_DRIVER_EN_CH_20: U10.5(Gate) ; port RELAY_DRIVER_EN_CH_20
RELAY_DRIVER_EN_CH_21: U11.5(Gate) ; port RELAY_DRIVER_EN_CH_21
RELAY_DRIVER_EN_CH_22: U11.2(Gate) ; port RELAY_DRIVER_EN_CH_22
RELAY_DRIVER_EN_CH_23: U12.5(Gate) ; port RELAY_DRIVER_EN_CH_23
RELAY_DRIVER_EN_CH_24: U12.2(Gate) ; port RELAY_DRIVER_EN_CH_24

### Notes on the sheet
- Relay drivers are low-side nFETs which are rated to 60V drain-source. Relay coil outputs are connected to RELAY_COIL_PWR_IN_CH_XY.
- Title
- Size:
- Date:
- B
- Revision:
- Time:
- Drawn By:
- Sheet
- of
- File:

### Library data of the parts
U1-U12 = Relay Driver Dual NUD3160DMT1G: IC INDCT LOAD DRVR INDUST SC74-6; Manufacturer: ON Semiconductor; Number of Outputs: 2; Max Supply Voltage: 60V; Rise Time: 600ns; Interface: On/Off; Max Output Current: 150mA; Gate to Source Voltage (Vgs): 12V; Power Dissipation: 380mW; Output Configuration: Low Side; Output Current: 200mA; Output Voltage: 61V; Current Rating: 263mA; Drain to Source Resistance: 1.8R; Element Configuration: Dual; On-State Resistance: 3.7R; Supplier 1: Arrow Electronics; Manufacturer Part Number: NUD3160DMT1G; RoHS: Yes; Category: Hot Swap Controllers; Stock 1: 33; Pricing 1: 1=0.44430, 10=0.32460, 25=0.32120 (USD); Mount: Surface Mount; Case/Package: SC; Number of Pins: 6; Contact Plating: Tin,Matte; Min Operating Temperature: -40°C; Max Operating Temperature: 125°C; Packaging: Tape and Reel; Package Quantity: 3000; Continuous Drain Current (ID): 150mA; Fall Time: 600ns; Number of Elements: 2; Drain to Source Breakdown Voltage: 60V; Drain to Source Voltage (Vdss): 60V; Length: 3mm; Width: 1.5mm; Height: 0.94mm; Radiation Hardening: No; Lead Free: Lead Free; Halogen Free: Halogen Free; RoHS Compliant: Yes; REACH SVHC: No SVHC; ComponentLink1URL: https://datasheet.ciiva.com/1955/nud3160-d-1955024.pdf?src-supplier=Digi-Key; ComponentLink1Description: https://datasheet.ciiva.com/1955/nud3160-d-1955024.pdf?src-supplier=Digi-Key; ComponentLink2URL: https://datasheet.ciiva.com/1609/1786838-1609180.pdf?src-supplier=Newark; ComponentLink2Description: https://datasheet.ciiva.com/1609/1786838-1609180.pdf?src-supplier=Newark; ComponentLink3URL: https://datasheet.ciiva.com/8114/nud3160-d-8114970.pdf?src-supplier=Avnet; ComponentLink3Description: https://datasheet.ciiva.com/8114/nud3160-d-8114970.pdf?src-supplier=Avnet; ComponentLink4URL: https://datasheet.ciiva.com/11168/nud3160-d-11168234.pdf?src-supplier=Avnet; ComponentLink4Description: https://datasheet.ciiva.com/11168/nud3160-d-11168234.pdf?src-supplier=Avnet; ComponentLink5URL: https://datasheet.ciiva.com/1955/nud3160-d-1955025.pdf?src-supplier=Digi-Key; ComponentLink5Description: https://datasheet.ciiva.com/1955/nud3160-d-1955025.pdf?src-supplier=Digi-Key; ComponentLink6URL: https://datasheet.ciiva.com/1955/nud3160-d-1955026.pdf?src-supplier=Digi-Key; ComponentLink6Description: https://datasheet.ciiva.com/1955/nud3160-d-1955026.pdf?src-supplier=Digi-Key; Supplier Part Number 1: NUD3160DMT1G

## Sheet Analog - High Speed SE.SchDoc: Analog - High Speed Single Ended
size B; DrawnBy: Jasper Yun; SheetNumber: 9; SheetTotal: 13; Competition: SAC 2021; Subteam: Avionics; University: McGill University; Location: Montreal, Quebec; Project: Avionics Project Name; MRT: McGill Rocket Team
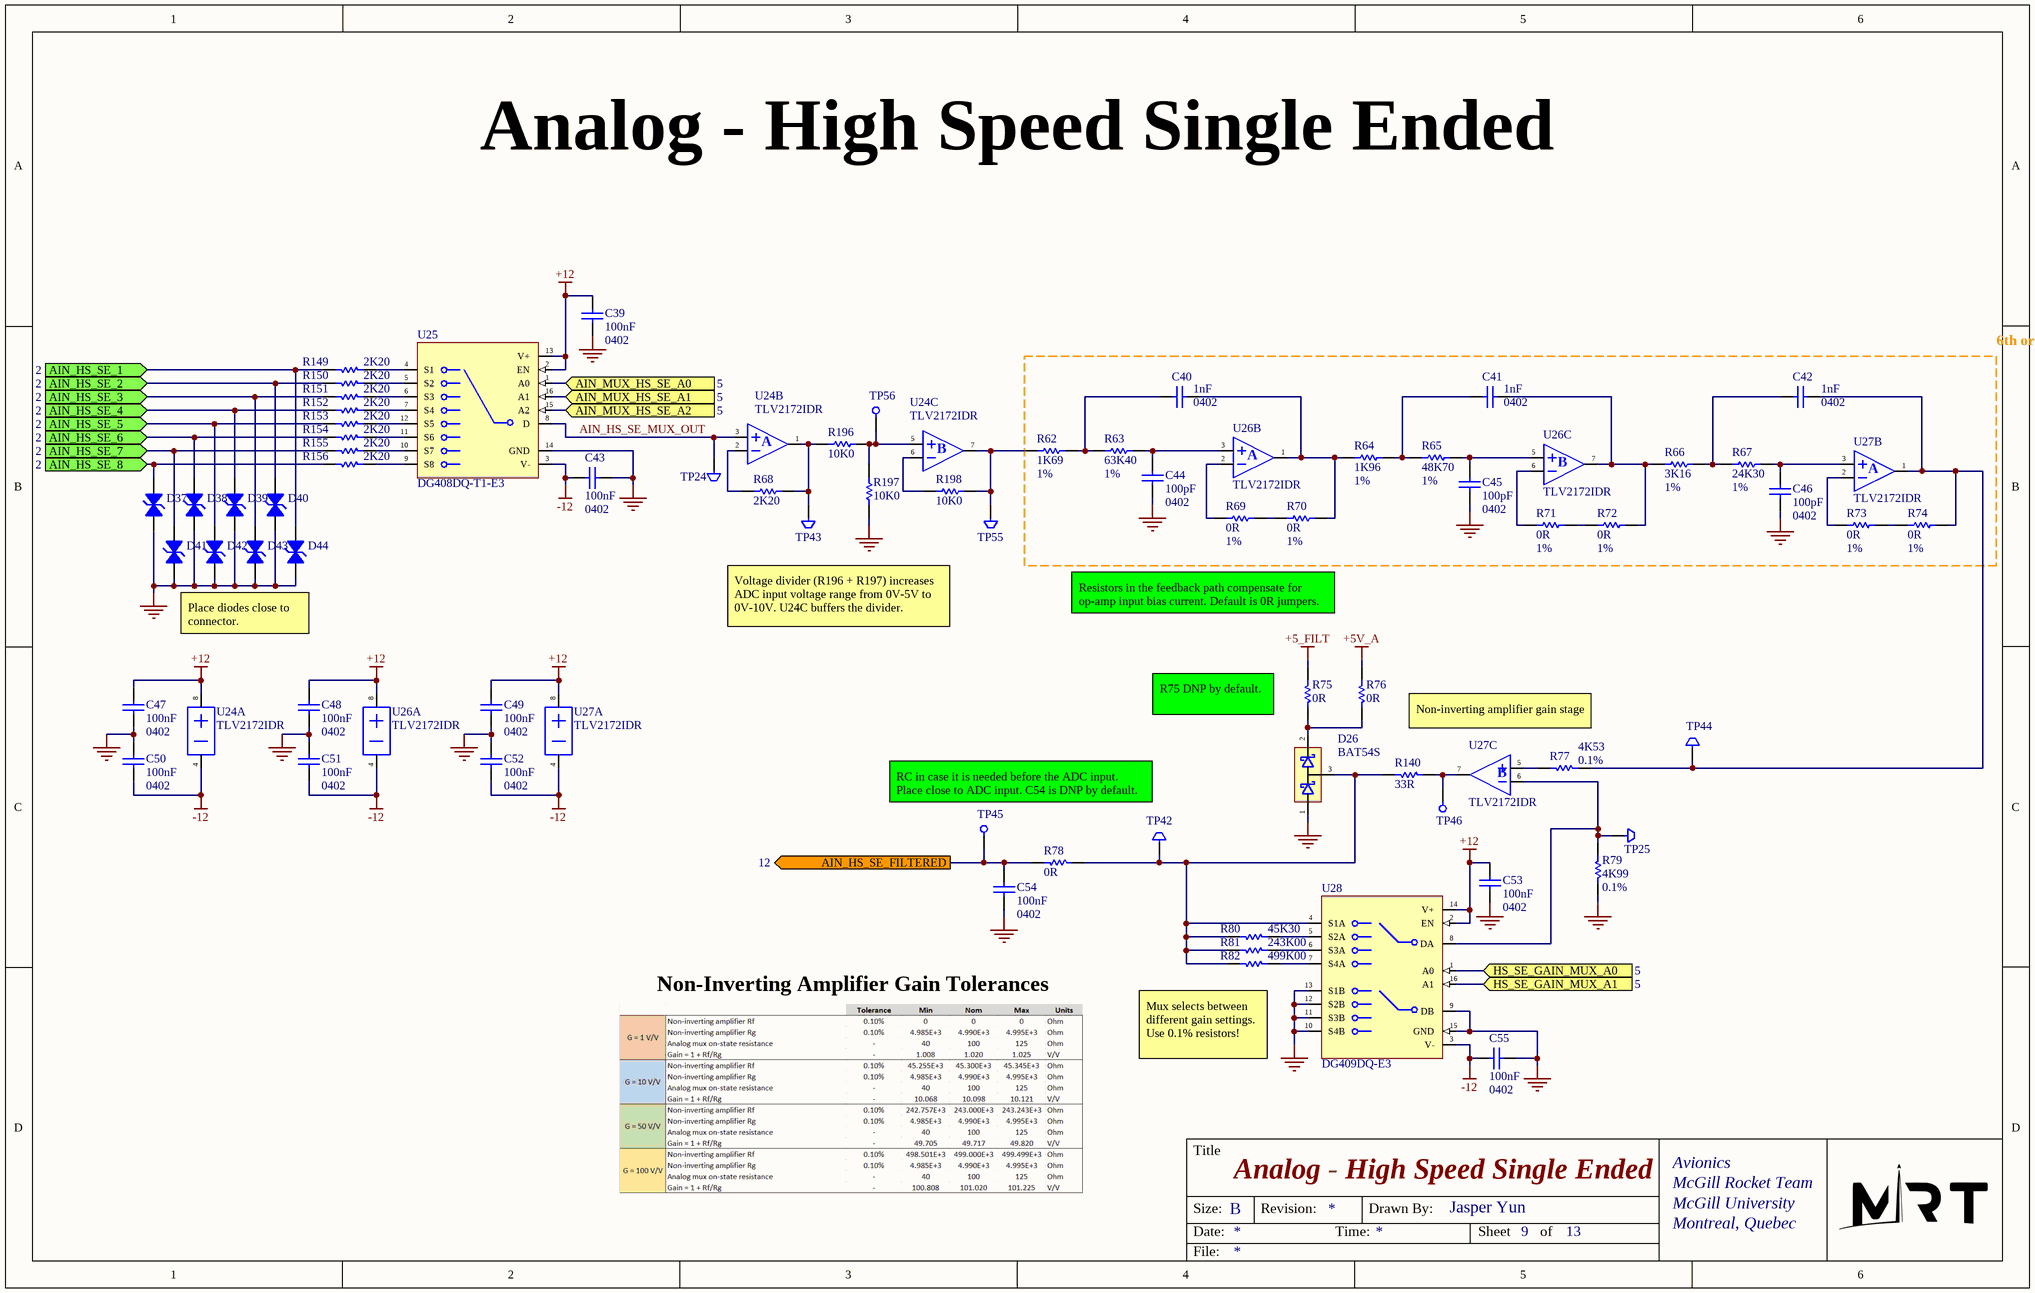
[diagram p8: Analog - High Speed SE.SchDoc]

### Parts
C39  100nF  value 0402  [0402 CAP]
C40  1nF  value 0402  [0402 CAP]
C41  1nF  value 0402  [0402 CAP]
C42  1nF  value 0402  [0402 CAP]
C43  100nF  value 0402  [0402 CAP]
C44  100pF  value 0402  [0402 CAP]
C45  100pF  value 0402  [0402 CAP]
C46  100pF  value 0402  [0402 CAP]
C47  100nF  value 0402  [0402 CAP]
C48  100nF  value 0402  [0402 CAP]
C49  100nF  value 0402  [0402 CAP]
C50  100nF  value 0402  [0402 CAP]
C51  100nF  value 0402  [0402 CAP]
C52  100nF  value 0402  [0402 CAP]
C53  100nF  value 0402  [0402 CAP]
C54  100nF  value 0402  [0402 CAP]
C55  100nF  value 0402  [0402 CAP]
D26  BAT54S  [SOT23-3]
D37  D12V0L1B2LP-7B  [DFN1006-2]  (value not drawn)
D38  D12V0L1B2LP-7B  [DFN1006-2]  (value not drawn)
D39  D12V0L1B2LP-7B  [DFN1006-2]  (value not drawn)
D40  D12V0L1B2LP-7B  [DFN1006-2]  (value not drawn)
D41  D12V0L1B2LP-7B  [DFN1006-2]  (value not drawn)
D42  D12V0L1B2LP-7B  [DFN1006-2]  (value not drawn)
D43  D12V0L1B2LP-7B  [DFN1006-2]  (value not drawn)
D44  D12V0L1B2LP-7B  [DFN1006-2]  (value not drawn)
R62  1K69  value 1%  [0402 RES]
R63  63K40  value 1%  [0402 RES]
R64  1K96  value 1%  [0402 RES]
R65  48K70  value 1%  [0402 RES]
R66  3K16  value 1%  [0402 RES]
R67  24K30  value 1%  [0402 RES]
R68  2K20  [0402 RES]
R69  0R  value 1%  [0402 RES]
R70  0R  value 1%  [0402 RES]
R71  0R  value 1%  [0402 RES]
R72  0R  value 1%  [0402 RES]
R73  0R  value 1%  [0402 RES]
R74  0R  value 1%  [0402 RES]
R75  0R  [0402 RES]
R76  0R  [0402 RES]
R77  4K53  value 0.1%  [0402 RES]
R78  0R  [0402 RES]
R79  4K99  value 0.1%  [0402 RES]
R80  45K30  [0402 RES]
R81  243K00  [0402 RES]
R82  499K00  [0402 RES]
R140  33R  [0402 RES]
R149  2K20  [0402 RES]
R150  2K20  [0402 RES]
R151  2K20  [0402 RES]
R152  2K20  [0402 RES]
R153  2K20  [0402 RES]
R154  2K20  [0402 RES]
R155  2K20  [0402 RES]
R156  2K20  [0402 RES]
R196  10K0  [0402 RES]
R197  10K0  [0402 RES]
R198  10K0  [0402 RES]
TP24  Test Point - Keystone 5015  [Test Point Keystone 5015]  (value not drawn)
TP25  Test Point - Keystone 5015  [Test Point Keystone 5015]  (value not drawn)
TP42  Test Point - Keystone 5015  [Test Point Keystone 5015]  (value not drawn)
TP43  Test Point - Keystone 5015  [Test Point Keystone 5015]  (value not drawn)
TP44  Test Point - Keystone 5015  [Test Point Keystone 5015]  (value not drawn)
TP45  Test Point - SMD Pad  [TEST POINT SMD PAD]  (value not drawn)  (no BOM)
TP46  Test Point - SMD Pad  [TEST POINT SMD PAD]  (value not drawn)  (no BOM)
TP55  Test Point - Keystone 5015  [Test Point Keystone 5015]  (value not drawn)
TP56  Test Point - SMD Pad  [TEST POINT SMD PAD]  (value not drawn)  (no BOM)
U24  TLV2172IDR  [SOIC-8]  (parts A,B,C of 3)
U25  DG408DQ-T1-E3  [TSSOP-16]
U26  TLV2172IDR  [SOIC-8]  (parts A,B,C of 3)
U27  TLV2172IDR  [SOIC-8]  (parts A,B,C of 3)
U28  DG409DQ-E3  [TSSOP-16]

### Blocks framed on the sheet
6th order Bessel Low Pass Filter (-3dB at 28kHz): C40-C42 C44-C46 R62-R67 R69-R74 U26 U27

### Ports
AIN_HS_SE_1 (in, see 2), AIN_HS_SE_2 (in, see 2), AIN_HS_SE_3 (in, see 2), AIN_HS_SE_4 (in, see 2), AIN_HS_SE_5 (in, see 2), AIN_HS_SE_6 (in, see 2), AIN_HS_SE_7 (in, see 2), AIN_HS_SE_8 (in, see 2), AIN_HS_SE_FILTERED (out, see 12), AIN_MUX_HS_SE_A0 (in, see 5), AIN_MUX_HS_SE_A1 (in, see 5), AIN_MUX_HS_SE_A2 (in, see 5), HS_SE_GAIN_MUX_A0 (in, see 5), HS_SE_GAIN_MUX_A1 (in, see 5)

### Nets
+5_FILT: R75.1
+5V_A: R76.1
+12: C39.2 C47.2 C48.2 C49.2 C53.2 U24.8(VCC+) U25.2(EN) U25.13(V+) U26.8(VCC+) U27.8(VCC+) U28.2(EN) U28.14(V+)
-12: C43.2 C50.1 C51.1 C52.1 C55.2 U24.4(VCC-) U25.3(V-) U26.4(VCC-) U27.4(VCC-) U28.3(V-)
GND: C39.1 C43.1 C44.1 C45.1 C46.1 C47.1 C48.1 C49.1 C50.2 C51.2 C52.2 C53.1 C54.1 C55.1 D26.1 D37.1 D38.1 D39.1 D40.1 D41.1 D42.1 D43.1 D44.1 R79.1 R197.1 U25.14(GND) U28.9(DB) U28.10(S4B) U28.11(S3B) U28.12(S2B) U28.13(S1B) U28.15(GND)
AIN_HS_SE_1: D44.2 R149.1 ; port AIN_HS_SE_1
AIN_HS_SE_2: D40.2 R150.1 ; port AIN_HS_SE_2
AIN_HS_SE_3: D43.2 R151.1 ; port AIN_HS_SE_3
AIN_HS_SE_4: D39.2 R152.1 ; port AIN_HS_SE_4
AIN_HS_SE_5: D42.2 R153.1 ; port AIN_HS_SE_5
AIN_HS_SE_6: D38.2 R154.1 ; port AIN_HS_SE_6
AIN_HS_SE_7: D41.2 R155.1 ; port AIN_HS_SE_7
AIN_HS_SE_8: D37.2 R156.1 ; port AIN_HS_SE_8
AIN_HS_SE_FILTERED: C54.2 R78.1 TP45.1 ; port AIN_HS_SE_FILTERED
AIN_HS_SE_MUX_OUT: TP24.1 U24.3 U25.8(D)
AIN_MUX_HS_SE_A0: U25.1(A0) ; port AIN_MUX_HS_SE_A0
AIN_MUX_HS_SE_A1: U25.16(A1) ; port AIN_MUX_HS_SE_A1
AIN_MUX_HS_SE_A2: U25.15(A2) ; port AIN_MUX_HS_SE_A2
HS_SE_GAIN_MUX_A0: U28.1(A0) ; port HS_SE_GAIN_MUX_A0
HS_SE_GAIN_MUX_A1: U28.16(A1) ; port HS_SE_GAIN_MUX_A1
NetC40_1: C40.1 R64.1 R70.2 U26.1
NetC40_2: C40.2 R62.2 R63.1
NetC41_1: C41.1 R66.1 R72.2 U26.7
NetC41_2: C41.2 R64.2 R65.1
NetC42_1: C42.1 R74.2 R77.2 TP44.1 U27.1
NetC42_2: C42.2 R66.2 R67.1
NetC44_2: C44.2 R63.2 U26.3
NetC45_2: C45.2 R65.2 U26.5
NetC46_2: C46.2 R67.2 U27.3
NetD26_2: D26.2 R75.2 R76.2
NetD26_3: D26.3 R78.2 R80.1 R81.1 R82.1 R140.1 TP42.1 U28.4(S1A)
NetR62_1: R62.1 R198.1 TP55.1 U24.7
NetR68_1: R68.1 U24.2
NetR68_2: R68.2 R196.2 TP43.1 U24.1
NetR69_1: R69.1 U26.2
NetR69_2: R69.2 R70.1
NetR71_1: R71.1 U26.6
NetR71_2: R71.2 R72.1
NetR73_1: R73.1 U27.2
NetR73_2: R73.2 R74.1
NetR77_1: R77.1 U27.5
NetR79_2: R79.2 TP25.1 U27.6 U28.8(DA)
NetR80_2: R80.2 U28.5(S2A)
NetR81_2: R81.2 U28.6(S3A)
NetR82_2: R82.2 U28.7(S4A)
NetR140_2: R140.2 TP46.1 U27.7
NetR149_2: R149.2 U25.4(S1)
NetR150_2: R150.2 U25.5(S2)
NetR151_2: R151.2 U25.6(S3)
NetR152_2: R152.2 U25.7(S4)
NetR153_2: R153.2 U25.12(S5)
NetR154_2: R154.2 U25.11(S6)
NetR155_2: R155.2 U25.10(S7)
NetR156_2: R156.2 U25.9(S8)
NetR196_1: R196.1 R197.2 TP56.1 U24.5
NetR198_2: R198.2 U24.6

### Notes on the sheet
- Place diodes close to connector.
- Voltage divider (R196 + R197) increases ADC input voltage range from 0V-5V to 0V-10V. U24C buffers the divider.
- Resistors in the feedback path compensate for op-amp input bias current. Default is 0R jumpers.
- R75 DNP by default.
- Non-inverting amplifier gain stage
- RC in case it is needed before the ADC input. Place close to ADC input. C54 is DNP by default.
- Non-Inverting Amplifier Gain Tolerances
- Mux selects between different gain settings.
  Use 0.1% resistors!
- Title
- Size:
- Date:
- B
- Revision:
- Time:
- Drawn By:
- Sheet
- of
- File:
- (in symbol OP AMP RC4580, part B) A
- (in symbol OP AMP RC4580, part C) B

### Library data of the parts
C39-C55 = Cap: Capacitor; Published: 8-Jun-2000; LatestRevisionDate: 17-Jul-2002; LatestRevisionNote: Re-released for DXP Platform.; PackageReference: RAD-0.3; Publisher: Altium Limited; PackageDescription: Radial Cap, Thru-Hole; 2 Leads; 0.3 in Pin Spacing
D26 = Schottky Diode Array BAT54S: as D3 on sheet Digital IO Protection; Supplier 1: Digi-Key; RoHS: Yes; Category: Rectifier Diodes; Stock 1: 2760; Pricing 1: 1=0.34000, 10=0.27800, 100=0.14730, 500=0.09694, 1000=0.06592 (USD); Mount: Surface Mount; Case/Package: SOT-23; Number of Pins: 3; Weight: 0.1lb; Min Operating Temperature: -40°C; Max Operating Temperature: 150°C; Reverse Recovery Time: 5ns; Max Repetitive Reverse Voltage (Vrrm): 40V; Packaging: Tape and Reel; Package Quantity: 3000; Average Rectified Current: 300mA; Max Forward Surge Current (Ifsm): 1A; Max Reverse Voltage (DC): 40V; Max Surge Current: 1A; Recovery Time: 5ns; Termination: SMD/SMT; Current Rating: 300mA; Length: 2.9mm; Width: 3.05mm; Height: 0.95mm; Radiation Hardening: No; REACH SVHC: No SVHC; RoHS Compliant: Yes; Lead Free: Lead Free; ComponentLink1URL: https://datasheet.ciiva.com/1200/1689724-1200683.pdf?src-supplier=Farnell; ComponentLink1Description: https://datasheet.ciiva.com/1200/1689724-1200683.pdf?src-supplier=Farnell; ComponentLink2URL: https://datasheet.ciiva.com/1177/1689724-1177974.pdf?src-supplier=Element14; ComponentLink2Description: https://datasheet.ciiva.com/1177/1689724-1177974.pdf?src-supplier=Element14; ComponentLink3URL: https://datasheet.ciiva.com/1200/cd00001322-1200682.pdf?src-supplier=Farnell; ComponentLink3Description: https://datasheet.ciiva.com/1200/cd00001322-1200682.pdf?src-supplier=Farnell; ComponentLink4URL: https://datasheet.ciiva.com/14168/cd00001322-14168028.pdf?src-supplier=Distrelec; ComponentLink4Description: https://datasheet.ciiva.com/14168/cd00001322-14168028.pdf?src-supplier=Distrelec; ComponentLink5URL: https://datasheet.ciiva.com/905/cd00001322-905882.pdf?src-supplier=Digi-Key; ComponentLink5Description: https://datasheet.ciiva.com/905/cd00001322-905882.pdf?src-supplier=Digi-Key; ComponentLink6URL: https://datasheet.ciiva.com/905/cd00001322-905881.pdf?src-supplier=Digi-Key; ComponentLink6Description: https://datasheet.ciiva.com/905/cd00001322-905881.pdf?src-supplier=Digi-Key; ComponentLink7URL: https://datasheet.ciiva.com/905/cd00001322-905883.pdf?src-supplier=Digi-Key; ComponentLink7Description: https://datasheet.ciiva.com/905/cd00001322-905883.pdf?src-supplier=Digi-Key; ComponentLink8URL: https://datasheet.ciiva.com/1177/1689724-1177973.pdf?src-supplier=Element14; ComponentLink8Description: https://datasheet.ciiva.com/1177/1689724-1177973.pdf?src-supplier=Element14; Supplier Part Number 1: 497-2522-1-ND
D37-D44 = Diode Zener Bidirectional: Bidirectional Zener diode
R62-R67 R69-R74 R77 R79 = Res1: Resistor; Published: 8-Jun-2000; LatestRevisionDate: 17-Jul-2002; LatestRevisionNote: Re-released for DXP Platform.; PackageReference: AXIAL-0.3; Publisher: Altium Limited; PackageDescription: Axial Device, Thru-Hole; 2 Leads; 0.3 in Pin Spacing
R68 R75 R76 R78 R80-R82 R140 R149-R156 R196-R198 = Res1: Resistor; Value: 1%; Published: 8-Jun-2000; LatestRevisionDate: 17-Jul-2002; LatestRevisionNote: Re-released for DXP Platform.; PackageReference: AXIAL-0.3; Publisher: Altium Limited; PackageDescription: Axial Device, Thru-Hole; 2 Leads; 0.3 in Pin Spacing
TP24 TP25 TP42-TP44 TP55 = Test Point - Keystone 5015: Keystone 5015 Test point
TP45 TP46 TP56 = Test Point - SMD Pad: SMD Pad test point
U24 U26 U27 = OP AMP RC4580: 2-channel, 12-MHz, low-noise, low-distortion audio op amp with high output current 8-SOIC -40 to 85; Manufacturer: Texas Instruments; Manufacturer Part Number: RC4580IDR; Min Supply Voltage: 4V; Max Supply Voltage: 32V; Max Dual Supply Voltage: 16V; Min Dual Supply Voltage: 2V; Voltage Gain: 110dB; Common Mode Rejection Ratio: 80dB; Nominal Gain Bandwidth Product: 12MHz; Number of Channels: 2; Slew Rate: 5V/µs; Max I/O Voltage: 3mV; Input Bias Current: 500nA; Operating Supply Current: 6mA; Output Current per Channel: 50mA; Nominal Supply Current: 4.5mA; Dual Supply Voltage: 9V; Load Impedance: 2kR; Supplier 1: Digi-Key; RoHS: Yes; Category: Amplifiers - Op Amps, Buffer, Instrumentation; Stock 1: 3503; Pricing 1: 1=0.46000, 10=0.37400, 25=0.34200, 100=0.25460, 250=0.23072, 500=0.19092, 1000=0.14320 (USD); Case/Package: D; Number of Pins: 8; Weight: 0.002561oz; Contact Plating: Gold; Min Operating Temperature: -40°C; Max Operating Temperature: 85°C; Packaging: Tape and Reel; Package Quantity: 1; Number of Circuits: 2; Gain Bandwidth Product: 12MHz; Input Offset Voltage (Vos): 3mV; Series: -; Supply Current: 4.5mA; Bandwidth: 12MHz; Unity Gain Bandwidth Product: 12MHz; Number of Elements: 2; Technology: BIPOLAR; Radiation Hardening: No; Lead Free: Lead Free; RoHS Compliant: Yes; Reach SVHC Compliant: No SVHC; ComponentLink1URL: https://datasheet.ciiva.com/23806/1716592-23806563.pdf?src-supplier=Newark; ComponentLink1Description: https://datasheet.ciiva.com/23806/1716592-23806563.pdf?src-supplier=Newark; ComponentLink2URL: https://datasheet.ciiva.com/22654/1882301-22654837.pdf?src-supplier=Element14; ComponentLink2Description: https://datasheet.ciiva.com/22654/1882301-22654837.pdf?src-supplier=Element14; ComponentLink3URL: https://datasheet.ciiva.com/46382/1840282-46382300.pdf?src-supplier=Element14; ComponentLink3Description: https://datasheet.ciiva.com/46382/1840282-46382300.pdf?src-supplier=Element14; ComponentLink4URL: https://datasheet.ciiva.com/1796/rc4580-1796261.pdf?src-supplier=Digi-Key; ComponentLink4Description: https://datasheet.ciiva.com/1796/rc4580-1796261.pdf?src-supplier=Digi-Key; ComponentLink5URL: https://datasheet.ciiva.com/1796/rc4580-1796260.pdf?src-supplier=Digi-Key; ComponentLink5Description: https://datasheet.ciiva.com/1796/rc4580-1796260.pdf?src-supplier=Digi-Key; ComponentLink6URL: https://datasheet.ciiva.com/1796/rc4580-1796262.pdf?src-supplier=Digi-Key; ComponentLink6Description: https://datasheet.ciiva.com/1796/rc4580-1796262.pdf?src-supplier=Digi-Key; Supplier Part Number 1: 296-15367-1-ND
U25 = Analog Mux DG408DQ-T1-E3: DG408DQ-T1-E3; Multiplexer Single 8: 1; 15 V; 18 V; 24 V; 28 V; 16-Pin TSSOP; Manufacturer: Vishay Siliconix; Min Supply Voltage: 13V; Max Supply Voltage: 44V; Number of Inputs: 8; Number of Outputs: 1; Operating Supply Voltage: 36V; Propagation Delay: 160ns; Max Power Dissipation: 600mW; Min Dual Supply Voltage: 5V; Max Dual Supply Voltage: 20V; Dual Supply Voltage: 15V; On-State Resistance: 90R; Turn-On Delay Time: 150ns; Max Supply Current: 500uA; Operating Supply Current: 1uA; Supply Type: Single,Dual; Nominal Supply Current: 10uA; High Level Output Current: 30mA; Supplier 1: RSComponents; Manufacturer Part Number: DG408DQ-T1-E3; RoHS: Yes; Category: Decoders and Multiplexers; Stock 1: 2985; Pricing 1: 5=2.69000, 50=2.02000, 250=1.57000 (GBP); Mount: Surface Mount; Case/Package: TSSOP; Number of Pins: 16; Weight: 0.006102oz; Contact Plating: Tin,Matte; Min Operating Temperature: -40°C; Max Operating Temperature: 85°C; Packaging: Tape and Reel; Number of Channels: 8; Package Quantity: 1; Turn-Off Delay Time: 150ns; Logic Function: Multiplexer; Power Dissipation: 600mW; Number of Circuits: 1; Series: -; Supply Current: 10uA; Length: 5.07mm; Width: 4.4mm; Height: 0.92mm; Radiation Hardening: No; Reach SVHC Compliant: Unknown; Lead Free: Lead Free; RoHS Compliant: Yes; ComponentLink1URL: https://datasheet.ciiva.com/15127/getdatasheetpartid-99309-15127097.pdf?src-supplier=Verical; ComponentLink1Description: https://datasheet.ciiva.com/15127/getdatasheetpartid-99309-15127097.pdf?src-supplier=Verical; ComponentLink2URL: https://datasheet.ciiva.com/11499/dg408-11499135.pdf?src-supplier=Avnet; ComponentLink2Description: https://datasheet.ciiva.com/11499/dg408-11499135.pdf?src-supplier=Avnet; ComponentLink3URL: https://datasheet.ciiva.com/1666/dg408-1666717.pdf?src-supplier=Digi-Key; ComponentLink3Description: https://datasheet.ciiva.com/1666/dg408-1666717.pdf?src-supplier=Digi-Key; ComponentLink4URL: https://datasheet.ciiva.com/1666/dg408-1666718.pdf?src-supplier=Digi-Key; ComponentLink4Description: https://datasheet.ciiva.com/1666/dg408-1666718.pdf?src-supplier=Digi-Key; ComponentLink5URL: https://datasheet.ciiva.com/1666/dg408-1666719.pdf?src-supplier=Digi-Key; ComponentLink5Description: https://datasheet.ciiva.com/1666/dg408-1666719.pdf?src-supplier=Digi-Key; Supplier Part Number 1: 2509481281
U28 = Analog Mux DG409DQ-E3: DG409 Series 20 V 8-Ch/Dual 4-Ch High-Performance CMOS Analog Multiplexer; Manufacturer: Vishay Siliconix; Min Supply Voltage: 13V; Max Supply Voltage: 44V; Number of Inputs: 8; Number of Outputs: 2; Number of Channels: 4; Min Dual Supply Voltage: 5V; Max Dual Supply Voltage: 20V; Propagation Delay: 160ns; On-State Resistance: 90R; Operating Supply Current: 1uA; Turn-On Delay Time: 150ns; Max Power Dissipation: 600mW; Max Supply Current: 500uA; Supply Type: Dual,Single; Dual Supply Voltage: 15V; Operating Supply Voltage: 36V; Supplier 1: Mouser; Manufacturer Part Number: DG409DQ-E3; RoHS: Yes; Category: Decoders and Multiplexers; Stock 1: 4584; Pricing 1: 1=4.36000, 10=3.91000, 50=3.70000, 100=3.20000, 1000=2.73000, 10000=2.40000 (USD); Mount: Surface Mount; Case/Package: TSSOP; Number of Pins: 16; Weight: 0.006102oz; Min Operating Temperature: -40°C; Max Operating Temperature: 85°C; Package Quantity: 360; Packaging: Rail/Tube; Logic Function: Multiplexer; Turn-Off Delay Time: 150ns; Power Dissipation: 600mW; Series: -; Length: 5.07mm; Width: 4.4mm; Height: 0.92mm; Radiation Hardening: No; Lead Free: Lead Free; RoHS Compliant: Yes; ComponentLink1URL: https://datasheet.ciiva.com/1677/dg408-1677556.pdf?src-supplier=Digi-Key; ComponentLink1Description: https://datasheet.ciiva.com/1677/dg408-1677556.pdf?src-supplier=Digi-Key; ComponentLink2URL: https://datasheet.ciiva.com/2978/dg408-2978747.pdf?src-supplier=Avnet; ComponentLink2Description: https://datasheet.ciiva.com/2978/dg408-2978747.pdf?src-supplier=Avnet; Supplier Part Number 1: 78-DG409DQ-E3